# EAGLE design LED-plus35-SHIM (EAGLE 9.6.2)

## Sheet 1 of 3
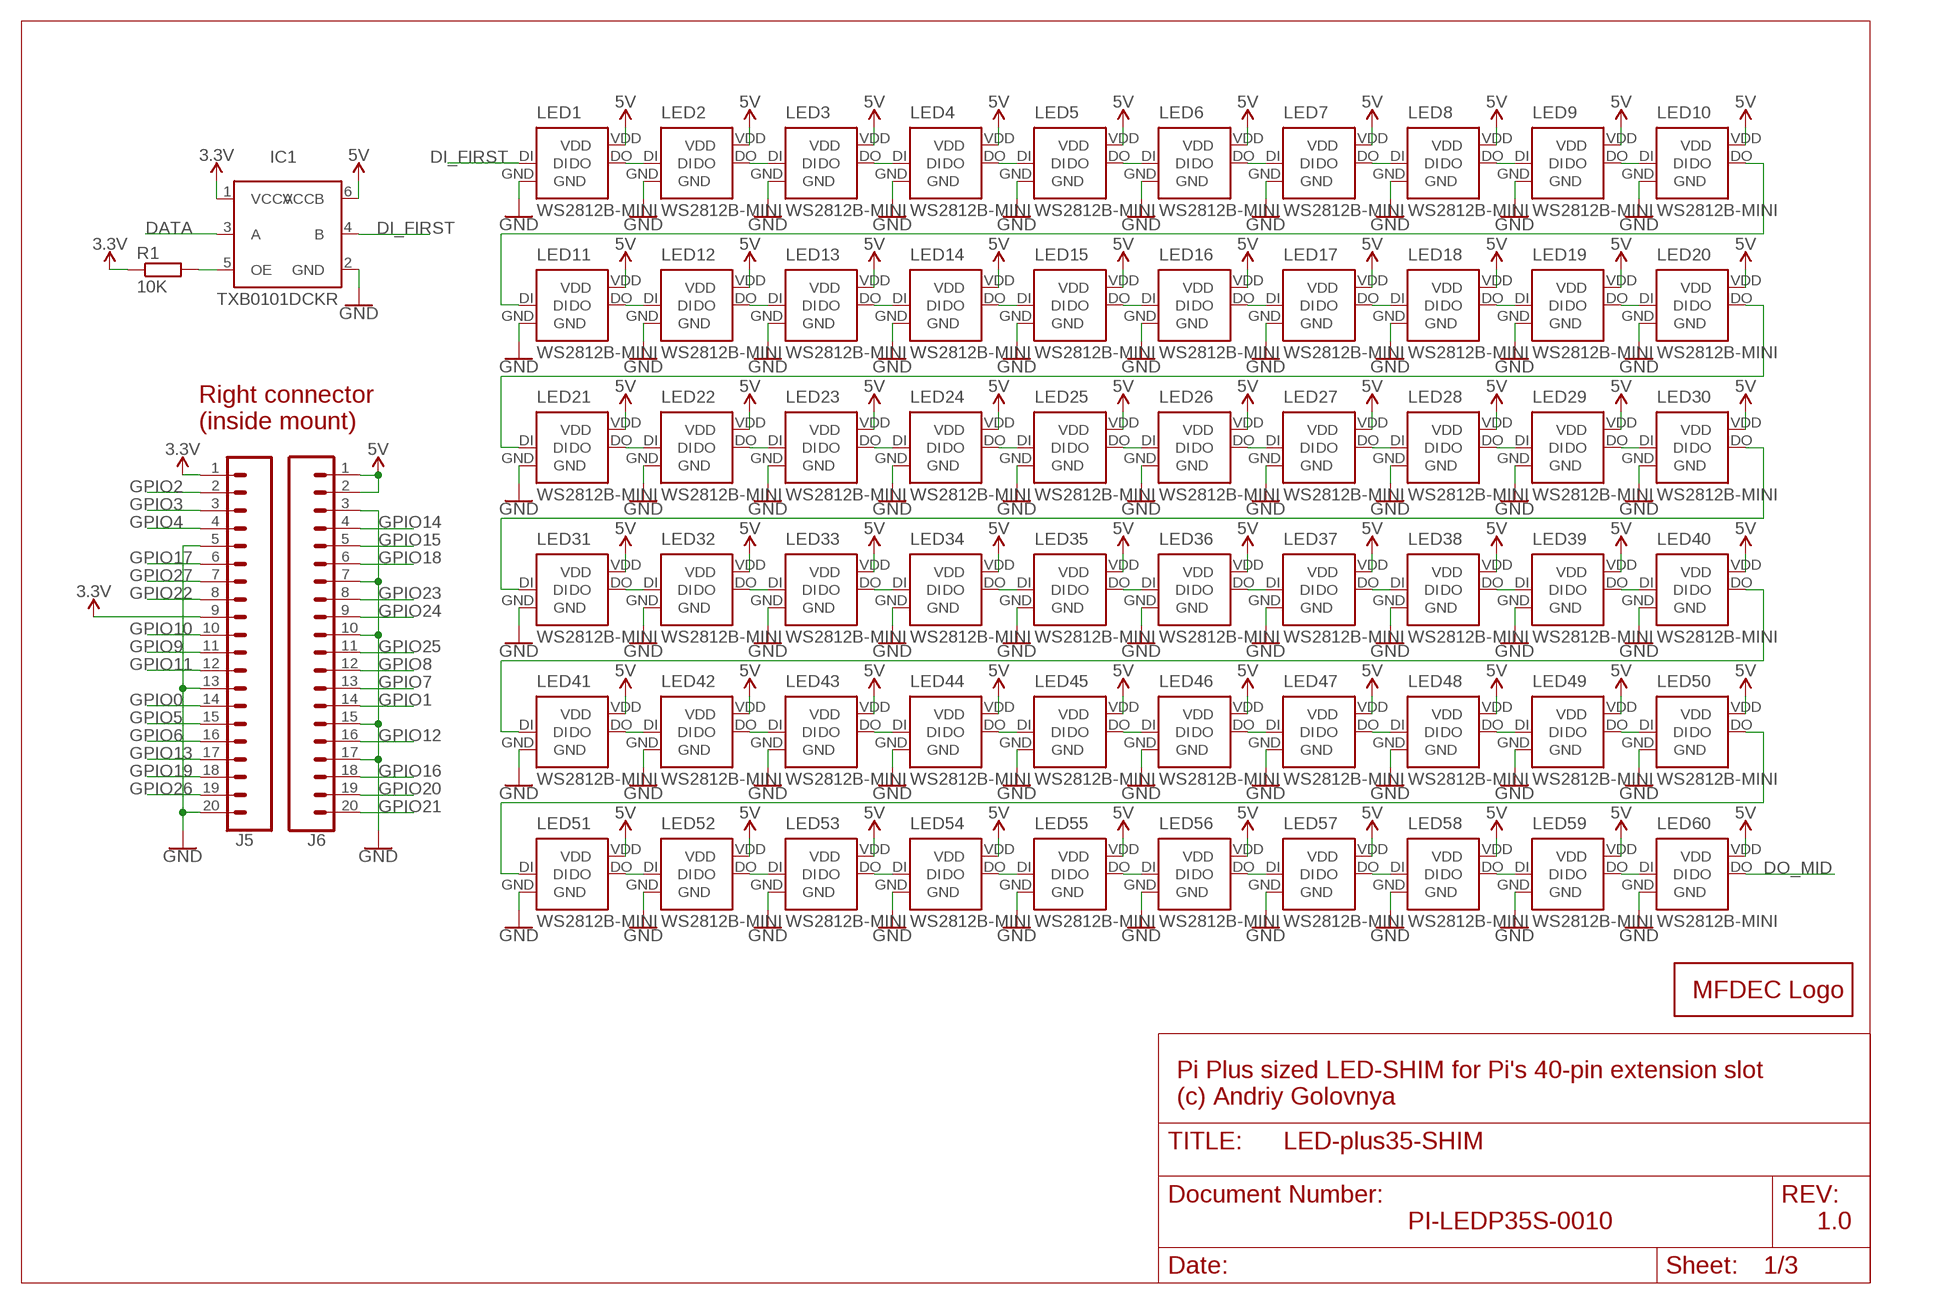
[diagram p0: schematic, sheet 1]

### Parts
IC1  TXB0101DCKR  [SOT65P210X110-6N]
J5  CONN_20LOCK  [1X20_LOCK]
J6  CONN_20LOCK  [1X20_LOCK]
LED1  WS2812B-MINI  [WS2812X-MINI]
LED2  WS2812B-MINI  [WS2812X-MINI]
LED3  WS2812B-MINI  [WS2812X-MINI]
LED4  WS2812B-MINI  [WS2812X-MINI]
LED5  WS2812B-MINI  [WS2812X-MINI]
LED6  WS2812B-MINI  [WS2812X-MINI]
LED7  WS2812B-MINI  [WS2812X-MINI]
LED8  WS2812B-MINI  [WS2812X-MINI]
LED9  WS2812B-MINI  [WS2812X-MINI]
LED10  WS2812B-MINI  [WS2812X-MINI]
LED11  WS2812B-MINI  [WS2812X-MINI]
LED12  WS2812B-MINI  [WS2812X-MINI]
LED13  WS2812B-MINI  [WS2812X-MINI]
LED14  WS2812B-MINI  [WS2812X-MINI]
LED15  WS2812B-MINI  [WS2812X-MINI]
LED16  WS2812B-MINI  [WS2812X-MINI]
LED17  WS2812B-MINI  [WS2812X-MINI]
LED18  WS2812B-MINI  [WS2812X-MINI]
LED19  WS2812B-MINI  [WS2812X-MINI]
LED20  WS2812B-MINI  [WS2812X-MINI]
LED21  WS2812B-MINI  [WS2812X-MINI]
LED22  WS2812B-MINI  [WS2812X-MINI]
LED23  WS2812B-MINI  [WS2812X-MINI]
LED24  WS2812B-MINI  [WS2812X-MINI]
LED25  WS2812B-MINI  [WS2812X-MINI]
LED26  WS2812B-MINI  [WS2812X-MINI]
LED27  WS2812B-MINI  [WS2812X-MINI]
LED28  WS2812B-MINI  [WS2812X-MINI]
LED29  WS2812B-MINI  [WS2812X-MINI]
LED30  WS2812B-MINI  [WS2812X-MINI]
LED31  WS2812B-MINI  [WS2812X-MINI]
LED32  WS2812B-MINI  [WS2812X-MINI]
LED33  WS2812B-MINI  [WS2812X-MINI]
LED34  WS2812B-MINI  [WS2812X-MINI]
LED35  WS2812B-MINI  [WS2812X-MINI]
LED36  WS2812B-MINI  [WS2812X-MINI]
LED37  WS2812B-MINI  [WS2812X-MINI]
LED38  WS2812B-MINI  [WS2812X-MINI]
LED39  WS2812B-MINI  [WS2812X-MINI]
LED40  WS2812B-MINI  [WS2812X-MINI]
LED41  WS2812B-MINI  [WS2812X-MINI]
LED42  WS2812B-MINI  [WS2812X-MINI]
LED43  WS2812B-MINI  [WS2812X-MINI]
LED44  WS2812B-MINI  [WS2812X-MINI]
LED45  WS2812B-MINI  [WS2812X-MINI]
LED46  WS2812B-MINI  [WS2812X-MINI]
LED47  WS2812B-MINI  [WS2812X-MINI]
LED48  WS2812B-MINI  [WS2812X-MINI]
LED49  WS2812B-MINI  [WS2812X-MINI]
LED50  WS2812B-MINI  [WS2812X-MINI]
LED51  WS2812B-MINI  [WS2812X-MINI]
LED52  WS2812B-MINI  [WS2812X-MINI]
LED53  WS2812B-MINI  [WS2812X-MINI]
LED54  WS2812B-MINI  [WS2812X-MINI]
LED55  WS2812B-MINI  [WS2812X-MINI]
LED56  WS2812B-MINI  [WS2812X-MINI]
LED57  WS2812B-MINI  [WS2812X-MINI]
LED58  WS2812B-MINI  [WS2812X-MINI]
LED59  WS2812B-MINI  [WS2812X-MINI]
LED60  WS2812B-MINI  [WS2812X-MINI]
LOGO1  MFDECLOGO_L_40MM  [MFDEC_L_40MM]
R1  10K  R-EU_R0402  [R0402]

### Nets
3.3V: IC1.1(VCCA) J5.1 J5.9 R1.1
5V: IC1.6(VCCB) J6.1 J6.2 LED1.VDD LED2.VDD LED3.VDD LED4.VDD LED5.VDD LED6.VDD LED7.VDD LED8.VDD LED9.VDD LED10.VDD LED11.VDD LED12.VDD LED13.VDD LED14.VDD LED15.VDD LED16.VDD LED17.VDD LED18.VDD LED19.VDD LED20.VDD LED21.VDD LED22.VDD LED23.VDD LED24.VDD LED25.VDD LED26.VDD LED27.VDD LED28.VDD LED29.VDD LED30.VDD LED31.VDD LED32.VDD LED33.VDD LED34.VDD LED35.VDD LED36.VDD LED37.VDD LED38.VDD LED39.VDD LED40.VDD LED41.VDD LED42.VDD LED43.VDD LED44.VDD LED45.VDD LED46.VDD LED47.VDD LED48.VDD LED49.VDD LED50.VDD LED51.VDD LED52.VDD LED53.VDD LED54.VDD LED55.VDD LED56.VDD LED57.VDD LED58.VDD LED59.VDD LED60.VDD ; also sheet 2,3
DATA: IC1.3(A) ; also sheet 2
DI_FIRST: IC1.4(B) LED1.DI ; also sheet 2
DO_MID: LED60.DO ; also sheet 2
GND: IC1.2(GND) J5.5 J5.13 J5.20 J6.3 J6.7 J6.10 J6.15 J6.17 LED1.GND LED2.GND LED3.GND LED4.GND LED5.GND LED6.GND LED7.GND LED8.GND LED9.GND LED10.GND LED11.GND LED12.GND LED13.GND LED14.GND LED15.GND LED16.GND LED17.GND LED18.GND LED19.GND LED20.GND LED21.GND LED22.GND LED23.GND LED24.GND LED25.GND LED26.GND LED27.GND LED28.GND LED29.GND LED30.GND LED31.GND LED32.GND LED33.GND LED34.GND LED35.GND LED36.GND LED37.GND LED38.GND LED39.GND LED40.GND LED41.GND LED42.GND LED43.GND LED44.GND LED45.GND LED46.GND LED47.GND LED48.GND LED49.GND LED50.GND LED51.GND LED52.GND LED53.GND LED54.GND LED55.GND LED56.GND LED57.GND LED58.GND LED59.GND LED60.GND ; also sheet 2,3
GPIO0: J5.14
GPIO1: J6.14
GPIO2: J5.2
GPIO3: J5.3
GPIO4: J5.4
GPIO5: J5.15
GPIO6: J5.16
GPIO7: J6.13
GPIO8: J6.12
GPIO9: J5.11
GPIO10: J5.10 ; also sheet 2
GPIO11: J5.12
GPIO12: J6.16
GPIO13: J5.17
GPIO14: J6.4
GPIO15: J6.5
GPIO16: J6.18
GPIO17: J5.6
GPIO18: J6.6 ; also sheet 2
GPIO19: J5.18
GPIO20: J6.19
GPIO21: J6.20 ; also sheet 2
GPIO22: J5.8
GPIO23: J6.8
GPIO24: J6.9
GPIO25: J6.11
GPIO26: J5.19
GPIO27: J5.7
N$1: LED1.DO LED2.DI
N$2: LED2.DO LED3.DI
N$3: LED3.DO LED4.DI
N$4: LED4.DO LED5.DI
N$5: LED5.DO LED6.DI
N$6: LED6.DO LED7.DI
N$7: LED7.DO LED8.DI
N$8: LED8.DO LED9.DI
N$9: LED9.DO LED10.DI
N$10: LED10.DO LED11.DI
N$11: LED20.DO LED21.DI
N$12: LED11.DO LED12.DI
N$13: LED12.DO LED13.DI
N$14: LED13.DO LED14.DI
N$15: LED14.DO LED15.DI
N$16: LED15.DO LED16.DI
N$17: LED16.DO LED17.DI
N$18: LED17.DO LED18.DI
N$19: LED18.DO LED19.DI
N$20: LED19.DO LED20.DI
N$22: LED21.DO LED22.DI
N$23: LED22.DO LED23.DI
N$24: LED23.DO LED24.DI
N$25: LED24.DO LED25.DI
N$26: LED25.DO LED26.DI
N$27: LED26.DO LED27.DI
N$28: LED27.DO LED28.DI
N$29: LED28.DO LED29.DI
N$30: LED29.DO LED30.DI
N$31: LED30.DO LED31.DI
N$32: LED31.DO LED32.DI
N$33: LED32.DO LED33.DI
N$34: LED33.DO LED34.DI
N$35: LED34.DO LED35.DI
N$36: LED35.DO LED36.DI
N$37: LED36.DO LED37.DI
N$38: LED37.DO LED38.DI
N$39: LED38.DO LED39.DI
N$40: LED39.DO LED40.DI
N$41: LED40.DO LED41.DI
N$42: LED41.DO LED42.DI
N$43: LED42.DO LED43.DI
N$44: LED43.DO LED44.DI
N$45: LED44.DO LED45.DI
N$46: LED45.DO LED46.DI
N$47: LED46.DO LED47.DI
N$48: LED47.DO LED48.DI
N$49: LED48.DO LED49.DI
N$50: LED49.DO LED50.DI
N$51: LED50.DO LED51.DI
N$53: LED51.DO LED52.DI
N$54: LED52.DO LED53.DI
N$55: LED53.DO LED54.DI
N$56: LED54.DO LED55.DI
N$57: LED55.DO LED56.DI
N$58: LED56.DO LED57.DI
N$59: LED57.DO LED58.DI
N$60: LED58.DO LED59.DI
N$61: LED59.DO LED60.DI
N$143: IC1.5(OE) R1.2

### Notes on the sheet
- Right connector
  (inside mount)
- Pi Plus sized LED-SHIM for Pi's 40-pin extension slot
  (c) Andriy Golovnya
- PI-LEDP35S-0010 | 1.0

## Sheet 2 of 3
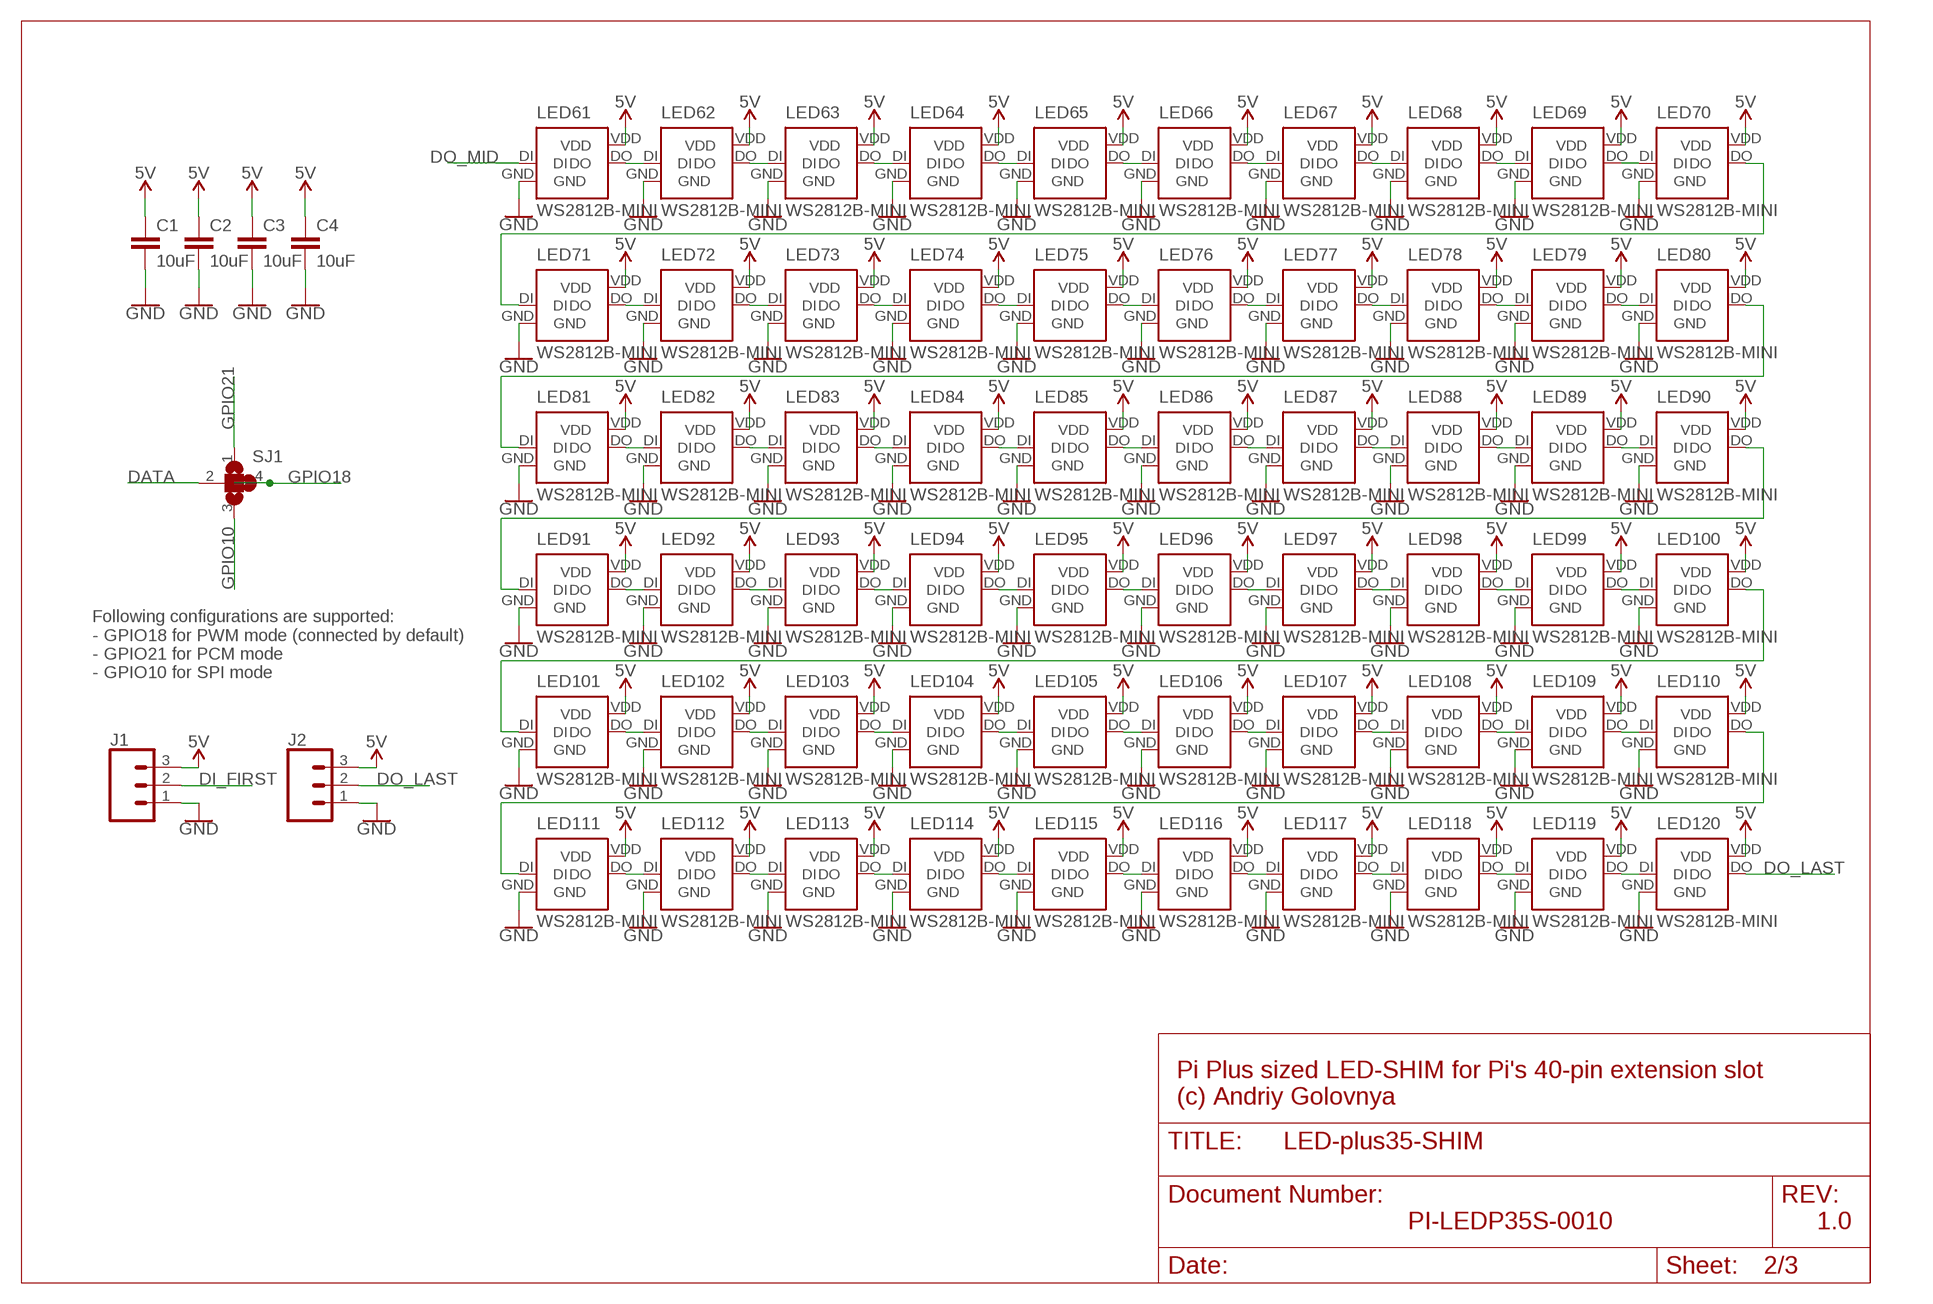
[diagram p1: schematic, sheet 2]

### Parts
C1  10uF  C-EUC0805  [C0805]
C2  10uF  C-EUC0805  [C0805]
C3  10uF  C-EUC0805  [C0805]
C4  10uF  C-EUC0805  [C0805]
J1  CONN_03  [1X03]
J2  CONN_03  [1X03]
LED61  WS2812B-MINI  [WS2812X-MINI]
LED62  WS2812B-MINI  [WS2812X-MINI]
LED63  WS2812B-MINI  [WS2812X-MINI]
LED64  WS2812B-MINI  [WS2812X-MINI]
LED65  WS2812B-MINI  [WS2812X-MINI]
LED66  WS2812B-MINI  [WS2812X-MINI]
LED67  WS2812B-MINI  [WS2812X-MINI]
LED68  WS2812B-MINI  [WS2812X-MINI]
LED69  WS2812B-MINI  [WS2812X-MINI]
LED70  WS2812B-MINI  [WS2812X-MINI]
LED71  WS2812B-MINI  [WS2812X-MINI]
LED72  WS2812B-MINI  [WS2812X-MINI]
LED73  WS2812B-MINI  [WS2812X-MINI]
LED74  WS2812B-MINI  [WS2812X-MINI]
LED75  WS2812B-MINI  [WS2812X-MINI]
LED76  WS2812B-MINI  [WS2812X-MINI]
LED77  WS2812B-MINI  [WS2812X-MINI]
LED78  WS2812B-MINI  [WS2812X-MINI]
LED79  WS2812B-MINI  [WS2812X-MINI]
LED80  WS2812B-MINI  [WS2812X-MINI]
LED81  WS2812B-MINI  [WS2812X-MINI]
LED82  WS2812B-MINI  [WS2812X-MINI]
LED83  WS2812B-MINI  [WS2812X-MINI]
LED84  WS2812B-MINI  [WS2812X-MINI]
LED85  WS2812B-MINI  [WS2812X-MINI]
LED86  WS2812B-MINI  [WS2812X-MINI]
LED87  WS2812B-MINI  [WS2812X-MINI]
LED88  WS2812B-MINI  [WS2812X-MINI]
LED89  WS2812B-MINI  [WS2812X-MINI]
LED90  WS2812B-MINI  [WS2812X-MINI]
LED91  WS2812B-MINI  [WS2812X-MINI]
LED92  WS2812B-MINI  [WS2812X-MINI]
LED93  WS2812B-MINI  [WS2812X-MINI]
LED94  WS2812B-MINI  [WS2812X-MINI]
LED95  WS2812B-MINI  [WS2812X-MINI]
LED96  WS2812B-MINI  [WS2812X-MINI]
LED97  WS2812B-MINI  [WS2812X-MINI]
LED98  WS2812B-MINI  [WS2812X-MINI]
LED99  WS2812B-MINI  [WS2812X-MINI]
LED100  WS2812B-MINI  [WS2812X-MINI]
LED101  WS2812B-MINI  [WS2812X-MINI]
LED102  WS2812B-MINI  [WS2812X-MINI]
LED103  WS2812B-MINI  [WS2812X-MINI]
LED104  WS2812B-MINI  [WS2812X-MINI]
LED105  WS2812B-MINI  [WS2812X-MINI]
LED106  WS2812B-MINI  [WS2812X-MINI]
LED107  WS2812B-MINI  [WS2812X-MINI]
LED108  WS2812B-MINI  [WS2812X-MINI]
LED109  WS2812B-MINI  [WS2812X-MINI]
LED110  WS2812B-MINI  [WS2812X-MINI]
LED111  WS2812B-MINI  [WS2812X-MINI]
LED112  WS2812B-MINI  [WS2812X-MINI]
LED113  WS2812B-MINI  [WS2812X-MINI]
LED114  WS2812B-MINI  [WS2812X-MINI]
LED115  WS2812B-MINI  [WS2812X-MINI]
LED116  WS2812B-MINI  [WS2812X-MINI]
LED117  WS2812B-MINI  [WS2812X-MINI]
LED118  WS2812B-MINI  [WS2812X-MINI]
LED119  WS2812B-MINI  [WS2812X-MINI]
LED120  WS2812B-MINI  [WS2812X-MINI]
SJ1  SJ3  [SJ_3]

### Nets
5V: C1.1 C2.1 C3.1 C4.1 J1.3 J2.3 LED61.VDD LED62.VDD LED63.VDD LED64.VDD LED65.VDD LED66.VDD LED67.VDD LED68.VDD LED69.VDD LED70.VDD LED71.VDD LED72.VDD LED73.VDD LED74.VDD LED75.VDD LED76.VDD LED77.VDD LED78.VDD LED79.VDD LED80.VDD LED81.VDD LED82.VDD LED83.VDD LED84.VDD LED85.VDD LED86.VDD LED87.VDD LED88.VDD LED89.VDD LED90.VDD LED91.VDD LED92.VDD LED93.VDD LED94.VDD LED95.VDD LED96.VDD LED97.VDD LED98.VDD LED99.VDD LED100.VDD LED101.VDD LED102.VDD LED103.VDD LED104.VDD LED105.VDD LED106.VDD LED107.VDD LED108.VDD LED109.VDD LED110.VDD LED111.VDD LED112.VDD LED113.VDD LED114.VDD LED115.VDD LED116.VDD LED117.VDD LED118.VDD LED119.VDD LED120.VDD ; also sheet 1,3
DATA: SJ1.2 ; also sheet 1
DI_FIRST: J1.2 ; also sheet 1
DO_LAST: J2.2 LED120.DO
DO_MID: LED61.DI ; also sheet 1
GND: C1.2 C2.2 C3.2 C4.2 J1.1 J2.1 LED61.GND LED62.GND LED63.GND LED64.GND LED65.GND LED66.GND LED67.GND LED68.GND LED69.GND LED70.GND LED71.GND LED72.GND LED73.GND LED74.GND LED75.GND LED76.GND LED77.GND LED78.GND LED79.GND LED80.GND LED81.GND LED82.GND LED83.GND LED84.GND LED85.GND LED86.GND LED87.GND LED88.GND LED89.GND LED90.GND LED91.GND LED92.GND LED93.GND LED94.GND LED95.GND LED96.GND LED97.GND LED98.GND LED99.GND LED100.GND LED101.GND LED102.GND LED103.GND LED104.GND LED105.GND LED106.GND LED107.GND LED108.GND LED109.GND LED110.GND LED111.GND LED112.GND LED113.GND LED114.GND LED115.GND LED116.GND LED117.GND LED118.GND LED119.GND LED120.GND ; also sheet 1,3
GPIO10: SJ1.3 ; also sheet 1
GPIO18: SJ1.4 ; also sheet 1
GPIO21: SJ1.1 ; also sheet 1
N$52: LED69.DO LED70.DI
N$63: LED61.DO LED62.DI
N$64: LED62.DO LED63.DI
N$65: LED63.DO LED64.DI
N$66: LED64.DO LED65.DI
N$67: LED65.DO LED66.DI
N$68: LED66.DO LED67.DI
N$69: LED67.DO LED68.DI
N$70: LED68.DO LED69.DI
N$71: LED70.DO LED71.DI
N$72: LED71.DO LED72.DI
N$73: LED72.DO LED73.DI
N$74: LED73.DO LED74.DI
N$75: LED74.DO LED75.DI
N$76: LED75.DO LED76.DI
N$77: LED76.DO LED77.DI
N$78: LED77.DO LED78.DI
N$79: LED78.DO LED79.DI
N$80: LED79.DO LED80.DI
N$81: LED80.DO LED81.DI
N$82: LED81.DO LED82.DI
N$83: LED82.DO LED83.DI
N$84: LED83.DO LED84.DI
N$85: LED84.DO LED85.DI
N$86: LED85.DO LED86.DI
N$87: LED86.DO LED87.DI
N$88: LED87.DO LED88.DI
N$89: LED88.DO LED89.DI
N$90: LED89.DO LED90.DI
N$91: LED90.DO LED91.DI
N$92: LED91.DO LED92.DI
N$93: LED92.DO LED93.DI
N$94: LED93.DO LED94.DI
N$95: LED94.DO LED95.DI
N$96: LED95.DO LED96.DI
N$97: LED96.DO LED97.DI
N$98: LED97.DO LED98.DI
N$99: LED98.DO LED99.DI
N$100: LED99.DO LED100.DI
N$101: LED100.DO LED101.DI
N$102: LED101.DO LED102.DI
N$103: LED102.DO LED103.DI
N$104: LED103.DO LED104.DI
N$105: LED104.DO LED105.DI
N$106: LED105.DO LED106.DI
N$107: LED106.DO LED107.DI
N$108: LED107.DO LED108.DI
N$109: LED108.DO LED109.DI
N$110: LED109.DO LED110.DI
N$111: LED110.DO LED111.DI
N$112: LED111.DO LED112.DI
N$113: LED112.DO LED113.DI
N$114: LED113.DO LED114.DI
N$115: LED114.DO LED115.DI
N$116: LED115.DO LED116.DI
N$117: LED116.DO LED117.DI
N$118: LED117.DO LED118.DI
N$119: LED118.DO LED119.DI
N$120: LED119.DO LED120.DI

### Notes on the sheet
- Following configurations are supported:
  - GPIO18 for PWM mode (connected by default)
  - GPIO21 for PCM mode
  - GPIO10 for SPI mode
- Pi Plus sized LED-SHIM for Pi's 40-pin extension slot
  (c) Andriy Golovnya
- PI-LEDP35S-0010 | 1.0

## Sheet 3 of 3
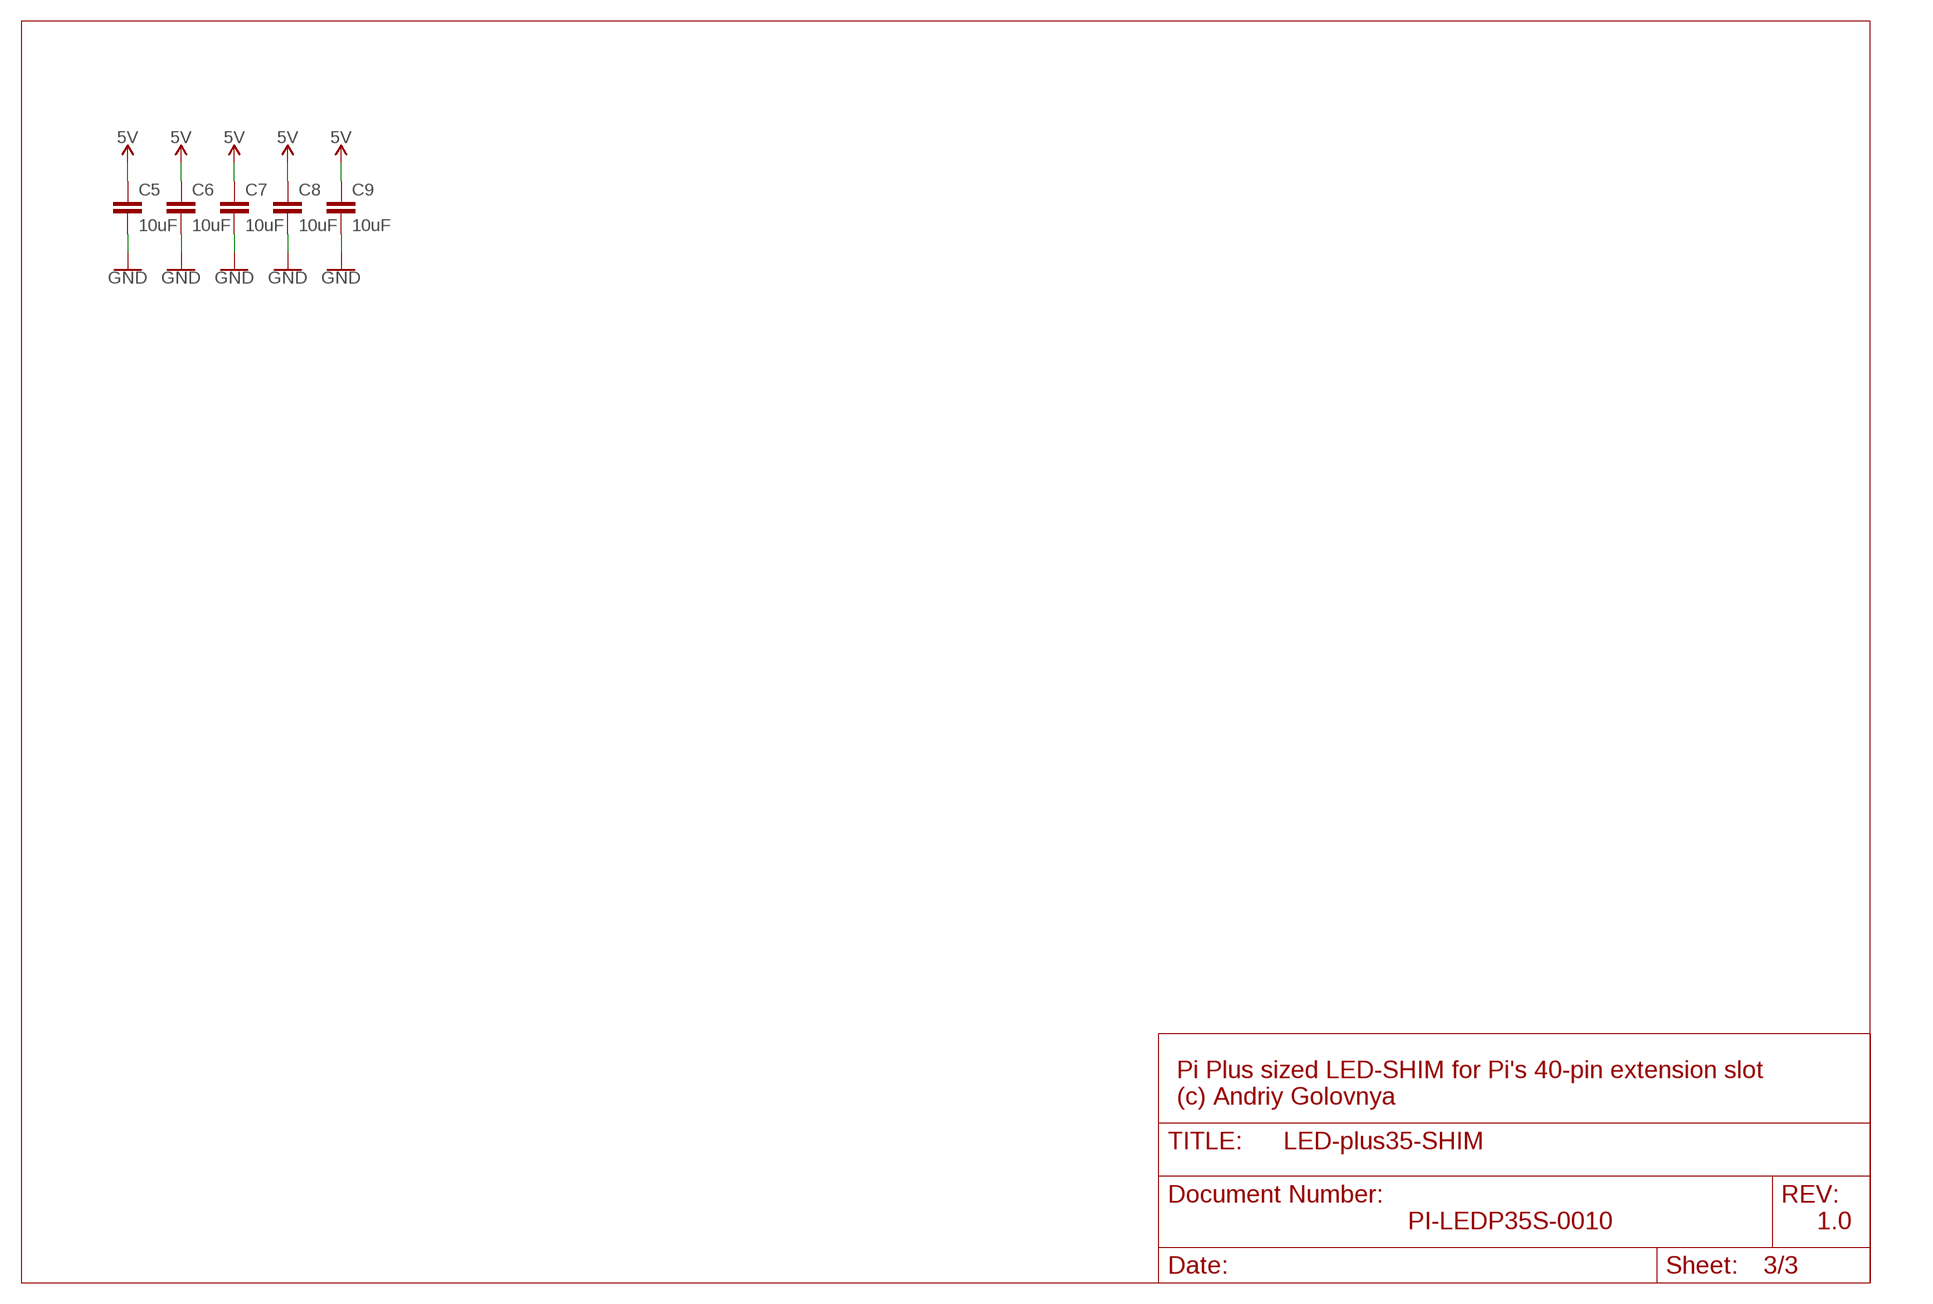
[diagram p2: schematic, sheet 3]

### Parts
C5  10uF  C-EUC0805  [C0805]
C6  10uF  C-EUC0805  [C0805]
C7  10uF  C-EUC0805  [C0805]
C8  10uF  C-EUC0805  [C0805]
C9  10uF  C-EUC0805  [C0805]

### Nets
5V: C5.1 C6.1 C7.1 C8.1 C9.1 ; also sheet 1,2
GND: C5.2 C6.2 C7.2 C8.2 C9.2 ; also sheet 1,2

### Notes on the sheet
- Pi Plus sized LED-SHIM for Pi's 40-pin extension slot
  (c) Andriy Golovnya
- PI-LEDP35S-0010 | 1.0

## Library data of the parts
C1-C9 = rcl:C-EU: CAPACITOR, European symbol; SPICEPREFIX: C
IC1 = TXB0101DCKR:TXB0101DCKR
J1 J2 = SparkFun-Connectors:CONN_03: Multi connection point. Often used as Generic Header-pin footprint for 0.1 inch spaced/style header connections On any of the 0.1 inch spaced packages, you can populate with these: Break Away Headers - Straight <https://www.sparkfun.com/products/116> (PRT-00116) Break Away Male Headers - Right Angle <https://www.sparkfun.com/products/553> (PRT-00553) Female Headers <https://www.sparkfun.com/products/115> (PRT-00115) Break Away Headers - Machine Pin <https://www.sparkfun.com/products/117> (PRT-00117) Break Away Female Headers - Swiss Machine Pin <https://www.sparkfun.com/products/743> (PRT-00743) Stackable Header - 3 Pin (Female, 0.1") <https://www.sparkfun.com/products/13875> (PRT-13875) For SCREWTERMINALS and SPRING TERMINALS visit here: Screw Terimnals on SparkFun.com <https://www.sparkfun.com/search/results?term=Screw+Terminals> (5mm/3.5mm/2.54mm spacing) This device is also useful as a general connection point to wire up your design to another part of your project. Our various solder wires solder well into these plated through hole pads. Hook-Up Wire - Assortment (Stranded, 22 AWG) <https://www.sparkfun.com/products/11375> (PRT-11375) Hook-Up Wire - Assortment (Solid Core, 22 AWG) <https://www.sparkfun.com/products/11367> (PRT-11367) View the entire wire category on our website here <https://www.sparkfun.com/categories/141> Special notes: Molex polarized connector foot print use with SKU : PRT-08232 with associated crimp pins and housings.
J5 J6 = _my_locked_connectors:CONN_20: Multi connection point. Often used as Generic Header-pin footprint for 0.1 inch spaced/style header connections On any of the 0.1 inch spaced packages, you can populate with these: Break Away Headers - Straight <https://www.sparkfun.com/products/116> (PRT-00116) Break Away Male Headers - Right Angle <https://www.sparkfun.com/products/553> (PRT-00553) Female Headers <https://www.sparkfun.com/products/115> (PRT-00115) Break Away Headers - Machine Pin <https://www.sparkfun.com/products/117> (PRT-00117) Break Away Female Headers - Swiss Machine Pin <https://www.sparkfun.com/products/743> (PRT-00743) For SCREWTERMINALS and SPRING TERMINALS visit here: Screw Terimnals on SparkFun.com <https://www.sparkfun.com/search/results?term=Screw+Terminals> (5mm/3.5mm/2.54mm spacing) This device is also useful as a general connection point to wire up your design to another part of your project. Our various solder wires solder well into these plated through hole pads. Hook-Up Wire - Assortment (Stranded, 22 AWG) <https://www.sparkfun.com/products/11375> (PRT-11375) Hook-Up Wire - Assortment (Solid Core, 22 AWG) <https://www.sparkfun.com/products/11367> (PRT-11367) View the entire wire category on our website here <https://www.sparkfun.com/categories/141> Special notes: Molex polarized connector foot print use with SKU : PRT-08231 with associated crimp pins and housings. 1MM SMD Version SKU: PRT-10208 NOTES ON THE VARIANTS LOCK and LOCK_LONGPADS... This footprint was designed to help hold the alignment of a through-hole component (i.e. 6-pin header) while soldering it into place. You may notice that each hole has been shifted either up or down by 0.005 of an inch from it's more standard position (which is a perfectly straight line). This slight alteration caused the pins (the squares in the middle) to touch the edges of the holes. Because they are alternating, it causes a "brace" to hold the component in place. 0.005 has proven to be the perfect amount of "off-center" position when using our standard breakaway headers. Although looks a little odd when you look at the bare footprint, once you have a header in there, the alteration is very hard to notice. Also,if you push a header all the way into place, it is covered up entirely on the bottom side. Note about LOCK SPECIAL package: This is just like the LOCK variant in that the holes are staggared by 5 mil, but except for the last two holes. They are not altered from the "standard" footprint layout. This is used for a special purpose on the layout of our Graphic LCD Backpack. Make sure you want to use this device before selecting it for you project!
LED1-LED120 = WS281X:WS2812: WS2812 RGB LED
LOGO1 = _my_logos:MFDECLOGO: Midnight Fog - Digital Eye Candy LOGO
R1 = rcl:R-EU_: RESISTOR, European symbol; SPICEPREFIX: R
SJ1 = _my_jumpers:SJ3: SMD solder JUMPER SJ3 - simple jumper SJ3FI - fancy inside jumper SJ3FO - fancy outside jumper SJ3W - wide jumper

## Board
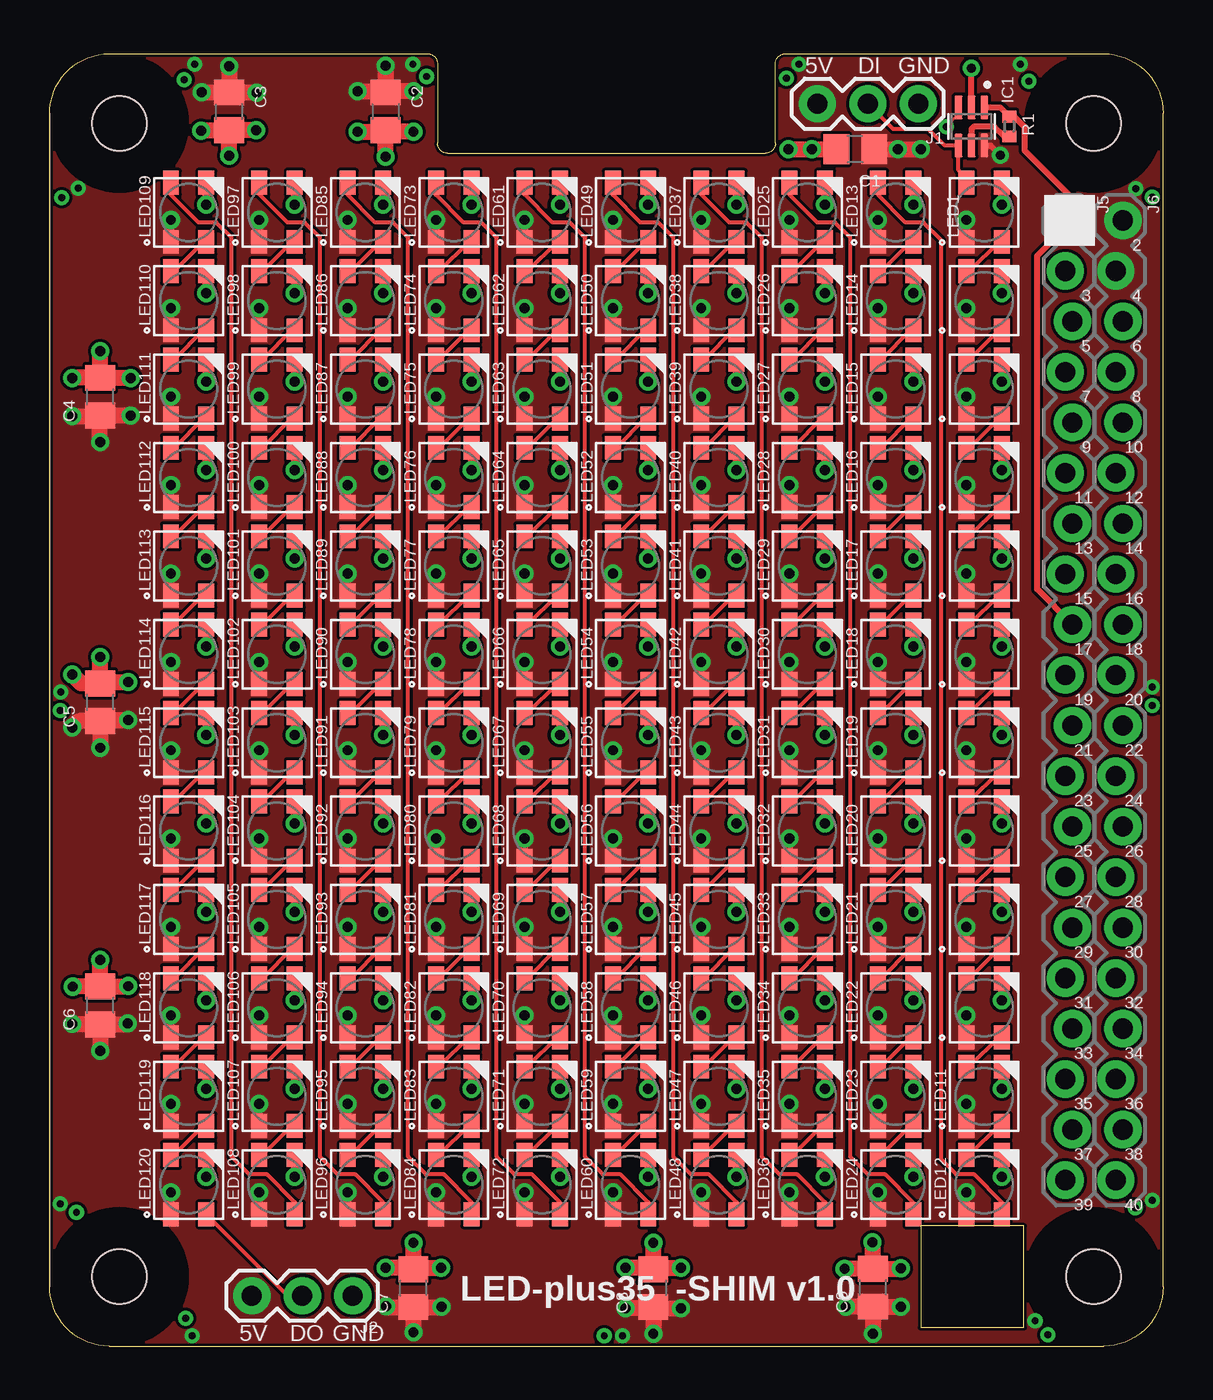
[diagram p3: board, top side]
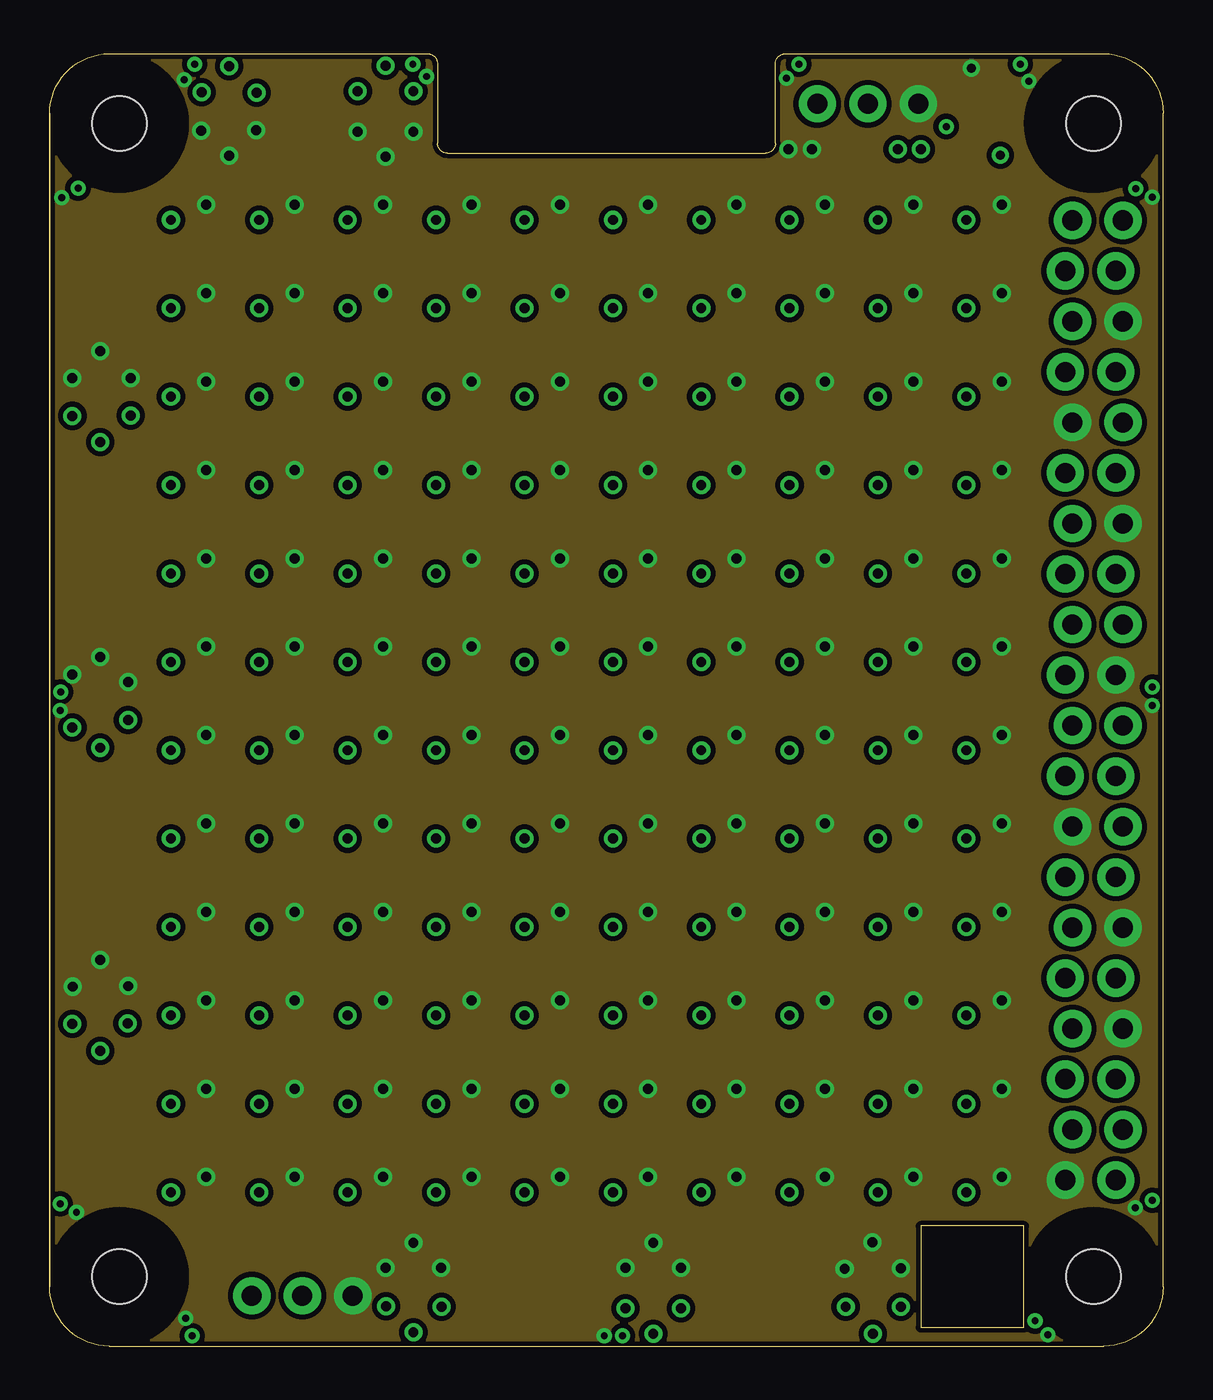
[diagram p4: board, inner layer Route2]
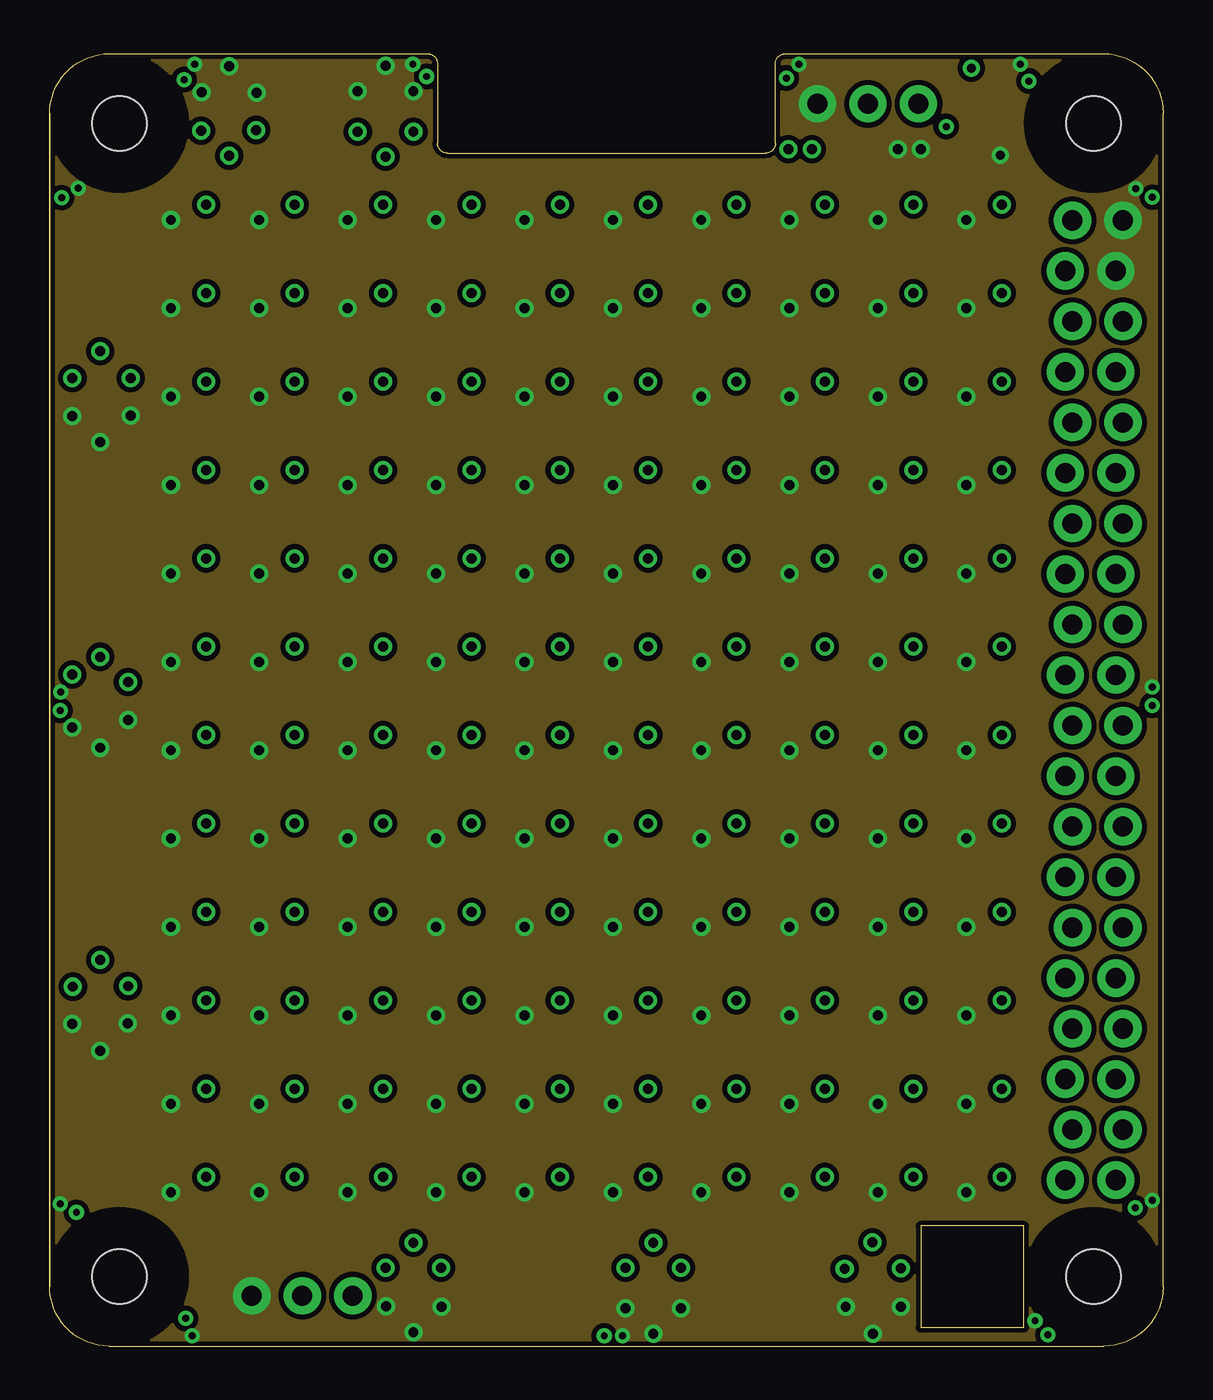
[diagram p5: board, inner layer Route15]
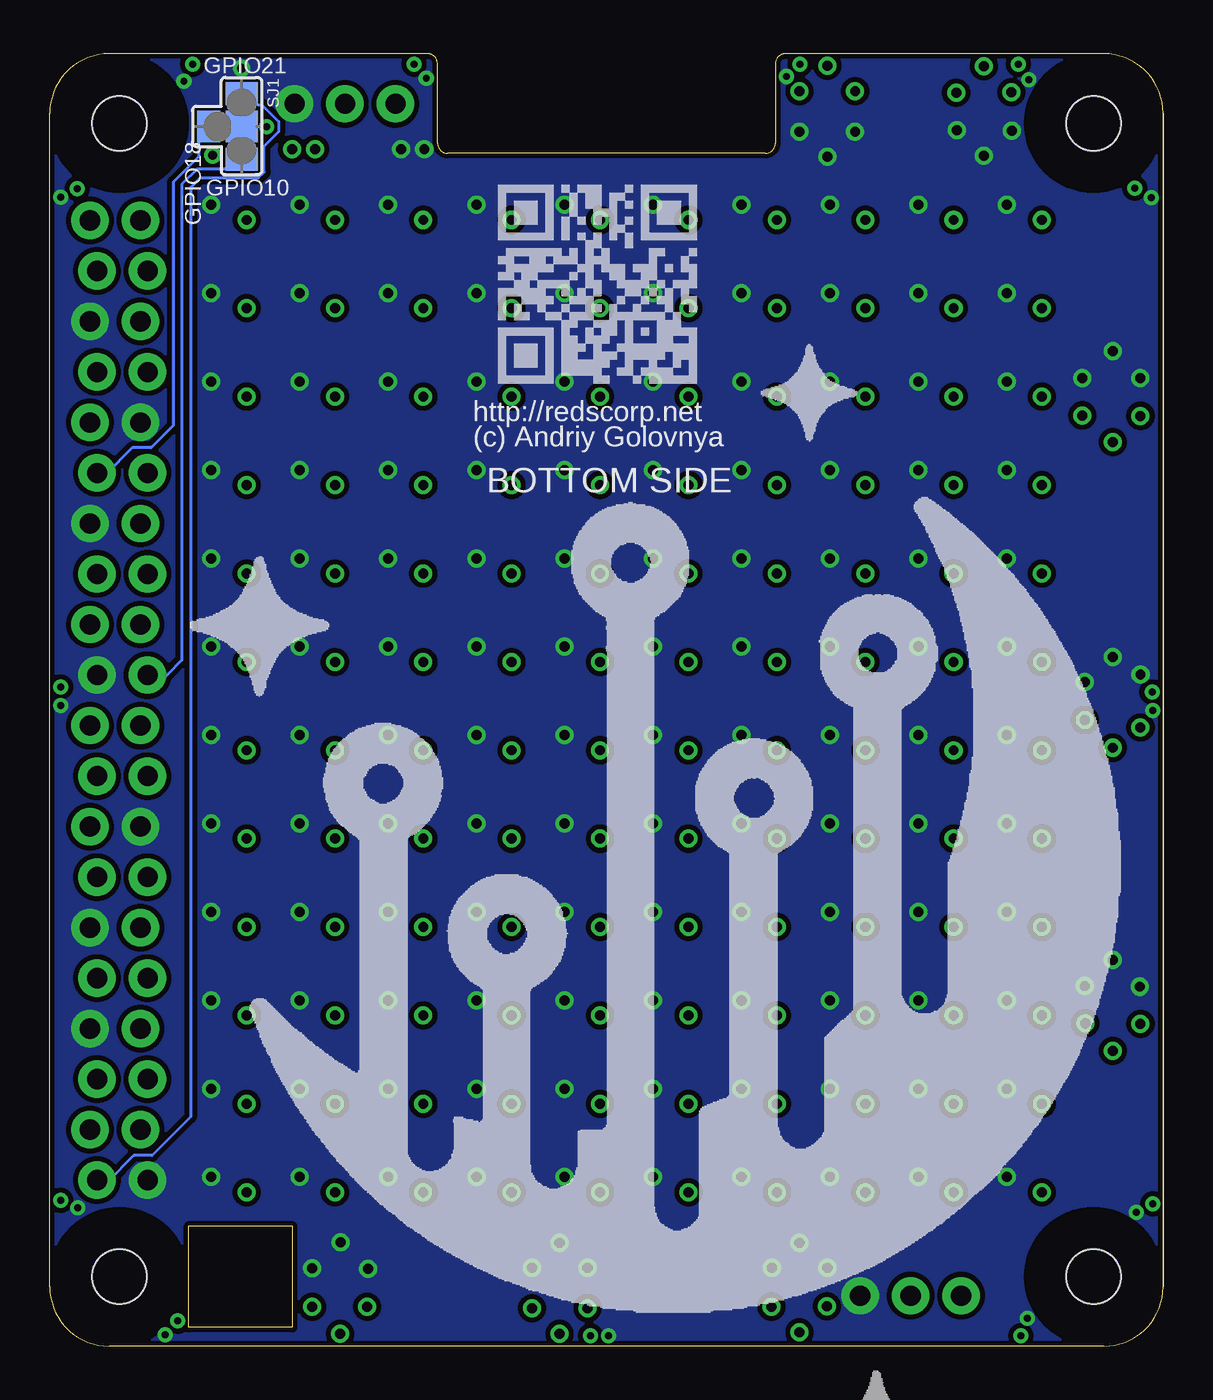
[diagram p6: board, bottom side, seen from below]

Size 56 x 65 mm. Coordinates in mm from the lower left corner, seen from the top.
Outline: 0,3 arc0 0,3 0,62 arc0 0,62
Outline: 0,62 0,3
Outline: 0,3 arc90 3,0 53,0 arc90 56,3 56,62 arc90 53,65 37,65 arc90 36.5,64.5 36.5,60.5 arc-90 36,60 20,60 arc-90 19.5,60.5 19.5,64.5 arc90 19,65 3,65 arc90 0,62
Outline: 43.8,0.95 49,0.95 49,6.05 43.8,6.05 43.8,0.95
Copper layers (1+2*15+16): Top 0.035mm / dielectric 0.2mm / Route2 0.035mm / dielectric 1.5mm / Route15 0.035mm / dielectric 0.2mm / Bottom 0.035mm
Design rules "default *": minimum track width 6mil, minimum drill 0.35mm, track to track 6mil, track to pad 6mil, pad to pad 6mil, via to via 6mil, smd to smd 6mil, copper to edge 6mil, drill to drill 6mil, minimum pad ring 10mil, minimum via ring 8mil, stop-mask expansion 4mil, vias tented up to drill 20mil, thermal gap 10mil
Holes 2.75 mm at 3.5,3.5 52.5,3.5 3.5,61.5 52.5,61.5

### Footprints (pad centres in the part's own frame; a part is rotated, then mirrored left to right if it is on the bottom)
C0805 = smd 1.3 x 1.5: 1 -0.95,0; 2 0.95,0
SOT65P210X110-6N = smd 1.19 x 0.4: 1 -0.96,0.65; 2 -0.96,0; 3 -0.96,-0.65; 4 0.96,-0.65; 5 0.96,0; 6 0.96,0.65
1X03 = drill 1.016 pad 1.88: 1 0,0; 2 2.54,0; 3 5.08,0
1X20_LOCK = drill 1.016 pad 1.88: 1 0,0.178; 2 2.54,-0.178; 3 5.08,0.178; 4 7.62,-0.178; 5 10.16,0.178; 6 12.7,-0.178; 7 15.24,0.178; 8 17.78,-0.178; 9 20.32,0.178; 10 22.86,-0.178; 11 25.4,0.178; 12 27.94,-0.178; 13 30.48,0.178; 14 33.02,-0.178; 15 35.56,0.178; 16 38.1,-0.178; 17 40.64,0.178; 18 43.18,-0.178; 19 45.72,0.178; 20 48.26,-0.178
WS2812X-MINI = smd 1.2 x 0.8: DI 1.49,0.89; DO -1.49,-0.89; GND 1.49,-0.89; VDD -1.49,0.89
R0402 = smd 0.6 x 0.7: 1 -0.5,0; 2 0.5,0
SJ_3 = smd 1.168 x 1.6: 1 -1.651,0; 3 1.651,0 | smd 1.6 x 1.6: 2 0,0 | smd 1.6 x 1.168: 4 0,-1.651

### Placement (x,y rotation side)
C1  40.51,60.2 180 top
C2  16.89,62.1 270 top
C3  9.02,62.1 270 top
C4  2.54,47.75 90 top
C5  2.54,32.38 90 top
C6  2.54,17.14 90 top
C7  18.29,2.92 90 top
C8  30.35,2.92 90 top
C9  41.4,2.95 90 top
IC1  46.36,61.34 270 top
J1  43.69,62.48 180 top
J2  15.24,2.54 180 top
J5  51.25,56.62 270 top
J6  53.79,56.62 270 top
LED1  46.99,57.02 90 top
LED2  46.99,52.58 90 top
LED3  46.99,48.13 90 top
LED4  46.99,43.69 90 top
LED5  46.99,39.24 90 top
LED6  46.99,34.8 90 top
LED7  46.99,30.35 90 top
LED8  46.99,25.91 90 top
LED9  46.99,21.46 90 top
LED10  46.99,17.02 90 top
LED11  46.99,12.57 90 top
LED12  46.99,8.13 90 top
LED13  42.55,57.02 90 top
LED14  42.55,52.58 90 top
LED15  42.55,48.13 90 top
LED16  42.55,43.69 90 top
LED17  42.55,39.24 90 top
LED18  42.55,34.8 90 top
LED19  42.55,30.35 90 top
LED20  42.55,25.91 90 top
LED21  42.55,21.46 90 top
LED22  42.55,17.02 90 top
LED23  42.55,12.57 90 top
LED24  42.55,8.13 90 top
LED25  38.1,57.02 90 top
LED26  38.1,52.58 90 top
LED27  38.1,48.13 90 top
LED28  38.1,43.69 90 top
LED29  38.1,39.24 90 top
LED30  38.1,34.8 90 top
LED31  38.1,30.35 90 top
LED32  38.1,25.91 90 top
LED33  38.1,21.46 90 top
LED34  38.1,17.02 90 top
LED35  38.1,12.57 90 top
LED36  38.1,8.13 90 top
LED37  33.66,57.02 90 top
LED38  33.66,52.58 90 top
LED39  33.66,48.13 90 top
LED40  33.66,43.69 90 top
LED41  33.66,39.24 90 top
LED42  33.66,34.8 90 top
LED43  33.66,30.35 90 top
LED44  33.66,25.91 90 top
LED45  33.66,21.46 90 top
LED46  33.66,17.02 90 top
LED47  33.66,12.57 90 top
LED48  33.66,8.13 90 top
LED49  29.21,57.02 90 top
LED50  29.21,52.58 90 top
LED51  29.21,48.13 90 top
LED52  29.21,43.69 90 top
LED53  29.21,39.24 90 top
LED54  29.21,34.8 90 top
LED55  29.21,30.35 90 top
LED56  29.21,25.91 90 top
LED57  29.21,21.46 90 top
LED58  29.21,17.02 90 top
LED59  29.21,12.57 90 top
LED60  29.21,8.13 90 top
LED61  24.77,57.02 90 top
LED62  24.77,52.58 90 top
LED63  24.77,48.13 90 top
LED64  24.77,43.69 90 top
LED65  24.77,39.24 90 top
LED66  24.77,34.8 90 top
LED67  24.77,30.35 90 top
LED68  24.77,25.91 90 top
LED69  24.77,21.46 90 top
LED70  24.77,17.02 90 top
LED71  24.77,12.57 90 top
LED72  24.77,8.13 90 top
LED73  20.32,57.02 90 top
LED74  20.32,52.58 90 top
LED75  20.32,48.13 90 top
LED76  20.32,43.69 90 top
LED77  20.32,39.24 90 top
LED78  20.32,34.8 90 top
LED79  20.32,30.35 90 top
LED80  20.32,25.91 90 top
LED81  20.32,21.46 90 top
LED82  20.32,17.02 90 top
LED83  20.32,12.57 90 top
LED84  20.32,8.13 90 top
LED85  15.88,57.02 90 top
LED86  15.88,52.58 90 top
LED87  15.88,48.13 90 top
LED88  15.88,43.69 90 top
LED89  15.88,39.24 90 top
LED90  15.88,34.8 90 top
LED91  15.88,30.35 90 top
LED92  15.88,25.91 90 top
LED93  15.88,21.46 90 top
LED94  15.88,17.02 90 top
LED95  15.88,12.57 90 top
LED96  15.88,8.13 90 top
LED97  11.43,57.02 90 top
LED98  11.43,52.58 90 top
LED99  11.43,48.13 90 top
LED100  11.43,43.69 90 top
LED101  11.43,39.24 90 top
LED102  11.43,34.8 90 top
LED103  11.43,30.35 90 top
LED104  11.43,25.91 90 top
LED105  11.43,21.46 90 top
LED106  11.43,17.02 90 top
LED107  11.43,12.57 90 top
LED108  11.43,8.13 90 top
LED109  6.99,57.02 90 top
LED110  6.99,52.58 90 top
LED111  6.99,48.13 90 top
LED112  6.99,43.69 90 top
LED113  6.99,39.24 90 top
LED114  6.99,34.8 90 top
LED115  6.99,30.35 90 top
LED116  6.99,25.91 90 top
LED117  6.99,21.46 90 top
LED118  6.99,17.02 90 top
LED119  6.99,12.57 90 top
LED120  6.99,8.13 90 top
LOGO1  -1.52,-10.03 90 bottom  (outside the outline)
LOGO3  RSNURL_QR_10MM  [RSNURL_QR_10MM]  33.45,48.42 0 bottom
R1  48.26,61.34 270 top
SJ1  46.36,61.34 270 bottom

### Tracks (layer width: path | path; a pad name or v marks a point on that pad's centre or on a via)
3.3V
  Top 0.305: IC1.1 47.8,62.3 R1.1 48.52,61.84 49.02,61.34 49.02,60.15 51.43,57.74 J5.1 49.66,54.84 49.66,38.07 J5.9
5V  (via drill 0.35, 0.45, 0.5)
  Top 0.305: IC1.6 47.32,60.38 v47.8,59.89
  Top 0.406: LED1.VDD v46.1,56.64 | LED2.VDD v46.1,52.2 | LED3.VDD v46.1,47.75 | LED4.VDD v46.1,43.31 | LED5.VDD v46.1,38.86 | LED6.VDD v46.1,34.42 | LED7.VDD v46.1,29.97 | LED8.VDD v46.1,25.53 | LED10.VDD v46.1,16.64 | LED11.VDD v46.1,12.19 | LED12.VDD v46.1,7.75 | LED9.VDD v46.1,21.08 | LED13.VDD v41.66,56.64 | LED14.VDD v41.66,52.2 | LED15.VDD v41.66,47.75 | LED16.VDD v41.66,43.31 | LED17.VDD v41.66,38.86 | LED18.VDD v41.66,34.42 | LED19.VDD v41.66,29.97 | LED20.VDD v41.66,25.53 | LED21.VDD v41.66,21.08 | LED22.VDD v41.66,16.64 | LED23.VDD v41.66,12.19 | LED24.VDD v41.66,7.75 | LED25.VDD v37.21,56.64 | LED26.VDD v37.21,52.2 | LED27.VDD v37.21,47.75 | LED28.VDD v37.21,43.31 | LED29.VDD v37.21,38.86 | LED30.VDD v37.21,34.42 | LED31.VDD v37.21,29.97 | LED32.VDD v37.21,25.53 | LED33.VDD v37.21,21.08 | LED34.VDD v37.21,16.64 | LED35.VDD v37.21,12.19 | LED36.VDD v37.21,7.75 | LED37.VDD v32.77,56.64 | LED38.VDD v32.77,52.2 | LED39.VDD v32.77,47.75 | LED40.VDD v32.77,43.31 | LED41.VDD v32.77,38.86 | LED42.VDD v32.77,34.42 | LED43.VDD v32.77,29.97 | LED44.VDD v32.77,25.53 | LED45.VDD v32.77,21.08 | LED46.VDD v32.77,16.64 | LED47.VDD v32.77,12.19 | LED48.VDD v32.77,7.75 | LED49.VDD v28.32,56.64 | LED50.VDD v28.32,52.2 | LED51.VDD v28.32,47.75 | LED52.VDD v28.32,43.31 | LED53.VDD v28.32,38.86 | LED54.VDD v28.32,34.42 | LED55.VDD v28.32,29.97 | LED56.VDD v28.32,25.53 | LED57.VDD v28.32,21.08 | LED58.VDD v28.32,16.64 | LED59.VDD v28.32,12.19 | LED60.VDD v28.32,7.75 | LED61.VDD v23.88,56.64 | LED62.VDD v23.88,52.2 | LED63.VDD v23.88,47.75 | LED64.VDD v23.88,43.31 | LED65.VDD v23.88,38.86 | LED66.VDD v23.88,34.42 | LED67.VDD v23.88,29.97 | LED68.VDD v23.88,25.53 | LED69.VDD v23.88,21.08 | LED70.VDD v23.88,16.64
  Top 0.406: LED71.VDD v23.88,12.19 | LED72.VDD v23.88,7.75 | LED73.VDD v19.43,56.64 | LED74.VDD v19.43,52.2 | LED75.VDD v19.43,47.75 | LED76.VDD v19.43,43.31 | LED77.VDD v19.43,38.86 | LED78.VDD v19.43,34.42 | LED79.VDD v19.43,29.97 | LED80.VDD v19.43,25.53 | LED81.VDD v19.43,21.08 | LED82.VDD v19.43,16.64 | LED83.VDD v19.43,12.19 | LED84.VDD v19.43,7.75 | LED85.VDD v14.99,56.64 | LED86.VDD v14.99,52.2 | LED87.VDD v14.99,47.75 | LED88.VDD v14.99,43.31 | LED89.VDD v14.99,38.86 | LED90.VDD v14.99,34.42 | LED91.VDD v14.99,29.97 | LED92.VDD v14.99,25.53 | LED93.VDD v14.99,21.08 | LED94.VDD v14.99,16.64 | LED95.VDD v14.99,12.19 | LED96.VDD v14.99,7.75 | LED97.VDD v10.54,56.64 | LED109.VDD v6.1,56.64 | LED98.VDD v10.54,52.2 | LED110.VDD v6.1,52.2 | LED99.VDD v10.54,47.75 | LED111.VDD v6.1,47.75 | LED100.VDD v10.54,43.31 | LED112.VDD v6.1,43.31 | LED101.VDD v10.54,38.86 | LED113.VDD v6.1,38.86 | LED102.VDD v10.54,34.42 | LED114.VDD v6.1,34.42 | LED103.VDD v10.54,29.97 | LED115.VDD v6.1,29.97 | LED104.VDD v10.54,25.53 | LED116.VDD v6.1,25.53 | LED105.VDD v10.54,21.08 | LED117.VDD v6.1,21.08 | LED106.VDD v10.54,16.64 | LED118.VDD v6.1,16.64 | LED107.VDD v10.54,12.19 | LED119.VDD v6.1,12.19 | LED108.VDD v10.54,7.75 | LED120.VDD v6.1,7.75
  Top 0.813: v1.14,46.79 2.53,46.79 | 2.53,46.79 C4.1 v4.05,46.8 v4.06,46.81 | v2.54,45.47 2.53,45.48 2.53,46.79 | C6.1 v2.54,14.86 | C6.1 1.15,16.2 v1.14,16.2 | C6.1 3.88,16.2 v3.91,16.23 | C5.1 v2.54,30.1 | C5.1 2.6,31.5 v3.94,31.5 | C5.1 1.46,31.43 v1.14,31.11 | C9.1 v41.4,0.64 | C9.1 40.05,2 v40.03,1.98 | C9.1 42.78,2 v42.8,1.98 | C8.1 v30.35,0.64 | C8.1 30.29,1.91 v28.96,1.91 | C8.1 30.42,1.91 v31.75,1.91 | v9.02,64.36 C3.1 | v10.41,63.04 C3.1 | v7.65,63.07 9,63.07 C3.1 | v19.71,1.98 v19.7,1.97 C7.1 | v18.29,0.71 C7.1 | v16.92,2.01 16.95,1.97 C7.1 | C1.1 v42.65,60.2 v43.82,60.2 | v15.49,63.12 16.83,63.12 | 16.83,63.12 C2.1 | v18.29,63.12 16.89,63.12 | 16.89,63.12 16.83,63.12 | v16.89,64.39 16.89,63.12
  other vias: 48.82,64.47 54.61,58.22 7.29,64.47 1.42,58.24 0.53,7.16 7.16,0.53 55.45,7.34 49.56,1.27 0.56,32.89 55.45,33.15 28.8,0.53 18.26,64.47 37.67,64.47
  pour Route15 (isolate 0.254, no thermals): 0,-3.81 0,65.15 56.01,65.15 56.01,-3.81
  pour Top (no thermals): 56.01,0 -4.32,0 -4.32,65.15 56.01,65.15
DATA  (via drill 0.35)
  Top 0.152: v45.09,61.34 45.71,61.96 IC1.3
  Bottom 0.152: SJ1.2 v45.09,61.34
DI_FIRST
  Top 0.203: J1.2 42.42,61.21 44.2,61.21 45.03,60.38 IC1.4 45.71,59.15 46.1,58.75 LED1.DI
DO_LAST
  Top 0.203: LED120.DO 11.97,2.54 J2.2
DO_MID
  Top 0.203: LED60.DO 30.1,7.25 28.71,8.64 27.82,8.64 26.92,9.53 26.92,55.75 26.16,56.51 25.29,56.51 23.88,57.93 LED61.DI
GND  (via drill 0.35, 0.45, 0.5)
  Top 0.305: IC1.2 v46.36,64.26
  Top 0.406: LED1.GND v47.88,57.41 v47.88,57.4 | LED2.GND v47.88,52.96 | LED3.GND v47.88,48.52 v47.88,48.51 | LED4.GND v47.88,44.07 | LED5.GND v47.88,39.62 | LED6.GND v47.88,35.18 | LED7.GND v47.88,30.73 | LED8.GND v47.88,26.29 | LED10.GND v47.88,17.4 | LED11.GND v47.88,12.96 v47.88,12.95 | LED12.GND v47.88,8.51 | LED9.GND v47.88,21.84 | LED13.GND v43.44,57.41 v43.43,57.4 | LED14.GND v43.44,52.96 v43.43,52.96 | LED15.GND v43.44,48.52 v43.43,48.51 | LED16.GND v43.44,44.07 v43.43,44.07 | LED17.GND v43.44,39.62 v43.43,39.62 | LED18.GND v43.44,35.18 v43.43,35.18 | LED19.GND v43.44,30.73 v43.43,30.73 | LED20.GND v43.44,26.29 v43.43,26.29 | LED21.GND v43.44,21.84 v43.43,21.84 | LED22.GND v43.44,17.4 v43.43,17.4 | LED23.GND v43.44,12.96 v43.43,12.95 | LED24.GND v43.44,8.51 v43.43,8.51 | LED25.GND v38.99,57.41 v38.99,57.4 | LED26.GND v38.99,52.96 | LED27.GND v38.99,48.52 v38.99,48.51 | LED28.GND v38.99,44.07 | LED29.GND v38.99,39.62 | LED30.GND v38.99,35.18 | LED31.GND v38.99,30.73 | LED32.GND v38.99,26.29 | LED33.GND v38.99,21.84 | LED34.GND v38.99,17.4 | LED35.GND v38.99,12.96 v38.99,12.95 | LED36.GND v38.99,8.51 | LED37.GND v34.55,57.41 v34.54,57.4 | LED38.GND v34.55,52.96 v34.54,52.96 | LED39.GND v34.55,48.52 v34.54,48.51 | LED40.GND v34.55,44.07 v34.54,44.07 | LED41.GND v34.55,39.62 v34.54,39.62 | LED42.GND v34.55,35.18 v34.54,35.18 | LED43.GND v34.55,30.73 v34.54,30.73 | LED44.GND v34.55,26.29 v34.54,26.29 | LED45.GND v34.55,21.84 v34.54,21.84 | LED46.GND v34.55,17.4 v34.54,17.4 | LED47.GND v34.55,12.96 v34.54,12.95 | LED48.GND v34.55,8.51 v34.54,8.51 | LED49.GND v30.1,57.41 v30.1,57.4 | LED50.GND v30.1,52.96 | LED51.GND v30.1,48.52 v30.1,48.51
  Top 0.406: LED52.GND v30.1,44.07 | LED53.GND v30.1,39.62 | LED54.GND v30.1,35.18 | LED55.GND v30.1,30.73 | LED56.GND v30.1,26.29 | LED57.GND v30.1,21.84 | LED58.GND v30.1,17.4 | LED59.GND v30.1,12.96 v30.1,12.95 | LED60.GND v30.1,8.51 | LED61.GND v25.66,57.41 v25.65,57.4 | LED62.GND v25.66,52.96 v25.65,52.96 | LED63.GND v25.66,48.52 v25.65,48.51 | LED64.GND v25.66,44.07 v25.65,44.07 | LED65.GND v25.66,39.62 v25.65,39.62 | LED66.GND v25.66,35.18 v25.65,35.18 | LED67.GND v25.66,30.73 v25.65,30.73 | LED68.GND v25.66,26.29 v25.65,26.29 | LED69.GND v25.66,21.84 v25.65,21.84 | LED70.GND v25.66,17.4 v25.65,17.4 | LED71.GND v25.66,12.96 v25.65,12.95 | LED72.GND v25.66,8.51 v25.65,8.51 | LED73.GND v21.21,57.41 v21.21,57.4 | LED74.GND v21.21,52.96 | LED75.GND v21.21,48.52 v21.21,48.51 | LED76.GND v21.21,44.07 | LED77.GND v21.21,39.62 | LED78.GND v21.21,35.18 | LED79.GND v21.21,30.73 | LED80.GND v21.21,26.29 | LED81.GND v21.21,21.84 | LED82.GND v21.21,17.4 | LED83.GND v21.21,12.96 v21.21,12.95 | LED84.GND v21.21,8.51 | LED85.GND v16.77,57.41 v16.76,57.4 | LED86.GND v16.77,52.96 v16.76,52.96 | LED87.GND v16.77,48.52 v16.76,48.51 | LED88.GND v16.77,44.07 v16.76,44.07 | LED89.GND v16.77,39.62 v16.76,39.62 | LED90.GND v16.77,35.18 v16.76,35.18 | LED91.GND v16.77,30.73 v16.76,30.73 | LED92.GND v16.77,26.29 v16.76,26.29 | LED93.GND v16.77,21.84 v16.76,21.84 | LED94.GND v16.77,17.4 v16.76,17.4 | LED95.GND v16.77,12.96 v16.76,12.95 | LED96.GND v16.77,8.51 v16.76,8.51 | LED97.GND v12.32,57.41 v12.32,57.4 | LED109.GND v7.88,57.41 v7.87,57.4 | LED98.GND v12.32,52.96 | LED110.GND v7.88,52.96 v7.87,52.96 | LED99.GND v12.32,48.52 v12.32,48.51 | LED111.GND v7.88,48.52 v7.87,48.51
  Top 0.406: LED100.GND v12.32,44.07 | LED112.GND v7.88,44.07 v7.87,44.07 | LED101.GND v12.32,39.62 | LED113.GND v7.88,39.62 v7.87,39.62 | LED102.GND v12.32,35.18 | LED114.GND v7.88,35.18 v7.87,35.18 | LED103.GND v12.32,30.73 | LED115.GND v7.88,30.73 v7.87,30.73 | LED104.GND v12.32,26.29 | LED116.GND v7.88,26.29 v7.87,26.29 | LED105.GND v12.32,21.84 | LED117.GND v7.88,21.84 v7.87,21.84 | LED106.GND v12.32,17.4 | LED118.GND v7.88,17.4 v7.87,17.4 | LED107.GND v12.32,12.96 v12.32,12.95 | LED119.GND v7.88,12.96 v7.87,12.95 | LED108.GND v12.32,8.51 | LED120.GND v7.88,8.51 v7.87,8.51
  Top 0.813: C4.2 1.15,48.7 v1.14,48.69 | C4.2 4.05,48.7 v4.06,48.69 | C4.2 v2.54,50.04 | C6.2 v2.54,19.43 | C6.2 1.18,18.09 v1.17,18.09 | C6.2 3.92,18.09 v3.94,18.11 | C5.2 v2.54,34.67 | C5.2 2.61,33.4 v3.94,33.4 | C5.2 1.58,33.34 v1.14,33.78 | C7.2 v18.29,5.21 | C7.2 18.22,3.94 v16.89,3.94 | C7.2 18.35,3.94 v19.69,3.94 | C9.2 v39.99,3.9 v39.98,3.89 | C9.2 41.4,5.21 v41.38,5.23 | C9.2 42.78,3.9 v42.8,3.91 | C8.2 v30.35,5.21 | C8.2 30.29,3.94 v28.96,3.94 | C8.2 30.42,3.94 v31.75,3.94 | v9.02,59.87 C3.2 9.03,61.16 | v10.39,61.16 9.03,61.16 | v7.62,61.14 7.65,61.16 9.03,61.16 | v37.16,60.2 v38.33,60.2 C1.2 | v15.49,61.09 16.83,61.09 | 16.83,61.09 C2.2 | v18.29,61.09 16.83,61.09 | v16.89,59.82 16.89,61.02 16.83,61.09
  other vias: 6.76,63.7 0.61,57.76 49.25,63.63 55.45,57.78 54.58,6.96 50.19,0.58 6.83,1.4 1.35,6.73 55.45,32.23 0.53,31.98 27.89,0.53 18.95,63.86 37.06,63.78
  pour Bottom (isolate 0.254, no thermals): 0,0 0,65.15 59.69,65.15 59.69,0
  pour Route2 (isolate 0.254, no thermals): 0,0 56.01,0 56.01,68.71 0,68.71
  cutout Top: 3.5,58 arc-180 3.5,65 arc-180
  cutout Route2: 3.5,58 arc-180 3.5,65 arc-180
  cutout Route15: 3.5,58 arc-180 3.5,65 arc-180
  cutout Bottom: 3.5,58 arc-180 3.5,65 arc-180
GND1
  cutout Top: 3.5,0 arc-180 3.5,7 arc-180
  cutout Route2: 3.5,0 arc-180 3.5,7 arc-180
  cutout Route15: 3.5,0 arc-180 3.5,7 arc-180
  cutout Bottom: 3.5,0 arc-180 3.5,7 arc-180
GND2
  cutout Top: 52.5,0 arc-180 52.5,7 arc-180
  cutout Route2: 52.5,0 arc-180 52.5,7 arc-180
  cutout Route15: 52.5,0 arc-180 52.5,7 arc-180
  cutout Bottom: 52.5,0 arc-180 52.5,7 arc-180
GND3
  cutout Top: 52.5,58 arc-180 52.5,65 arc-180
  cutout Route2: 52.5,58 arc-180 52.5,65 arc-180
  cutout Route15: 52.5,58 arc-180 52.5,65 arc-180
  cutout Bottom: 52.5,58 arc-180 52.5,65 arc-180
GPIO10
  Bottom 0.152: SJ1.3 46.57,59.69 47.07,59.19 48.6,59.19 49.35,58.43 49.35,34.5 50.1,33.76 J5.10
GPIO18
  Bottom 0.152: 46.88,61.34 SJ1.4 48.01,61.21 48.51,60.71 48.51,59.82 49.78,58.55 49.78,46.31 50.91,45.19 51.85,45.19 53.12,43.91 J6.6
GPIO21
  Bottom 0.152: SJ1.1 46.1,62.99 45.56,62.45 45.33,62.45 44.48,61.59 44.48,61.09 45.21,60.36 45.21,59.05 45.51,58.75 48.43,58.75 48.92,58.27 48.92,11.54 50.86,9.6 51.77,9.6 53.02,8.36 J6.20
N$1
  Top 0.203: LED1.DO 47.73,55.53 46.26,54.07 LED2.DI
N$2
  Top 0.203: LED2.DO 47.73,51.09 46.26,49.62 LED3.DI
N$3
  Top 0.203: LED3.DO 47.73,46.64 46.26,45.18 LED4.DI
N$4
  Top 0.203: LED4.DO 47.73,42.2 46.26,40.73 LED5.DI
N$5
  Top 0.203: LED5.DO 47.73,37.75 46.26,36.29 LED6.DI
N$6
  Top 0.203: LED6.DO 47.73,33.31 46.26,31.84 LED7.DI
N$7
  Top 0.203: LED7.DO 47.7,28.86 46.24,27.4 LED8.DI
N$8
  Top 0.203: LED8.DO 47.73,24.42 46.26,22.95 LED9.DI
N$9
  Top 0.203: LED9.DO 47.73,19.97 46.26,18.51 LED10.DI
N$10
  Top 0.203: LED10.DO 47.73,15.53 46.26,14.06 LED11.DI
N$11
  Top 0.203: LED20.DO 43.28,24.42 41.82,22.95 LED21.DI
N$12
  Top 0.203: LED11.DO 47.73,11.08 46.26,9.62 LED12.DI
N$13
  Top 0.203: LED12.DO 47.88,7.25 46.49,8.64 45.59,8.64 44.83,9.4 44.83,55.62 43.94,56.51 43.04,56.51 41.66,57.9 LED13.DI
N$14
  Top 0.203: LED13.DO 43.28,55.53 41.82,54.07 LED14.DI
N$15
  Top 0.203: LED14.DO 43.28,51.09 41.82,49.62 LED15.DI
N$16
  Top 0.203: LED15.DO 43.28,46.64 41.82,45.18 LED16.DI
N$17
  Top 0.203: LED16.DO 43.28,42.2 41.82,40.73 LED17.DI
N$18
  Top 0.203: LED17.DO 43.28,37.75 41.82,36.29 LED18.DI
N$19
  Top 0.203: LED18.DO 43.28,33.31 41.82,31.84 LED19.DI
N$20
  Top 0.203: LED19.DO 43.28,28.86 41.82,27.4 LED20.DI
N$22
  Top 0.203: LED21.DO 43.28,19.97 41.82,18.51 LED22.DI
N$23
  Top 0.203: LED22.DO 43.28,15.53 41.82,14.06 LED23.DI
N$24
  Top 0.203: LED23.DO 43.28,11.08 41.82,9.62 LED24.DI
N$25
  Top 0.203: LED24.DO 43.44,7.22 42.02,8.64 41.15,8.64 40.26,9.53 40.26,55.75 39.5,56.51 38.6,56.51 37.21,57.9 LED25.DI
N$26
  Top 0.203: LED25.DO 38.84,55.53 37.37,54.07 LED26.DI
N$27
  Top 0.203: LED26.DO 38.84,51.09 37.37,49.62 LED27.DI
N$28
  Top 0.203: LED27.DO 38.81,46.64 37.35,45.18 LED28.DI
N$29
  Top 0.203: LED28.DO 38.84,42.2 37.37,40.73 LED29.DI
N$30
  Top 0.203: LED29.DO 38.84,37.75 37.37,36.29 LED30.DI
N$31
  Top 0.203: LED30.DO 38.84,33.31 37.37,31.84 LED31.DI
N$32
  Top 0.203: LED31.DO 38.84,28.86 37.37,27.4 LED32.DI
N$33
  Top 0.203: LED32.DO 38.84,24.42 37.37,22.95 LED33.DI
N$34
  Top 0.203: LED33.DO 38.84,19.97 37.37,18.51 LED34.DI
N$35
  Top 0.203: LED34.DO 38.84,15.53 37.37,14.06 LED35.DI
N$36
  Top 0.203: LED35.DO 38.84,11.08 37.37,9.62 LED36.DI
N$37
  Top 0.203: LED36.DO 38.99,7.25 37.6,8.64 36.71,8.64 35.81,9.53 35.81,55.75 35.05,56.51 34.18,56.51 32.77,57.93 LED37.DI
N$38
  Top 0.203: LED37.DO 34.39,55.53 32.93,54.07 LED38.DI
N$39
  Top 0.203: LED38.DO 34.39,51.09 32.93,49.62 LED39.DI
N$40
  Top 0.203: LED39.DO 34.39,46.64 32.93,45.18 LED40.DI
N$41
  Top 0.203: LED40.DO 34.39,42.2 32.93,40.73 LED41.DI
N$42
  Top 0.203: LED41.DO 34.39,37.75 32.93,36.29 LED42.DI
N$43
  Top 0.203: LED42.DO 34.39,33.31 32.93,31.84 LED43.DI
N$44
  Top 0.203: LED43.DO 34.39,28.86 32.93,27.4 LED44.DI
N$45
  Top 0.203: LED44.DO 34.39,24.42 32.93,22.95 LED45.DI
N$46
  Top 0.203: LED45.DO 34.37,19.97 32.9,18.51 LED46.DI
N$47
  Top 0.203: LED46.DO 34.39,15.53 32.93,14.06 LED47.DI
N$48
  Top 0.203: LED47.DO 34.37,11.08 32.9,9.62 LED48.DI
N$49
  Top 0.203: LED48.DO 34.55,7.25 33.16,8.64 32.26,8.64 31.37,9.53 31.37,55.75 30.61,56.51 29.71,56.51 28.32,57.9 LED49.DI
N$50
  Top 0.203: LED49.DO 29.95,55.53 28.48,54.07 LED50.DI
N$51
  Top 0.203: LED50.DO 29.95,51.09 28.48,49.62 LED51.DI
N$52
  Top 0.203: LED69.DO 25.49,19.97 24.03,18.51 LED70.DI
N$53
  Top 0.203: LED51.DO 29.95,46.64 28.48,45.18 LED52.DI
N$54
  Top 0.203: LED52.DO 29.95,42.2 28.48,40.73 LED53.DI
N$55
  Top 0.203: LED53.DO 29.95,37.75 28.48,36.29 LED54.DI
N$56
  Top 0.203: LED54.DO 29.92,33.31 28.46,31.84 LED55.DI
N$57
  Top 0.203: LED55.DO 29.95,28.86 28.48,27.4 LED56.DI
N$58
  Top 0.203: LED56.DO 29.95,24.42 28.48,22.95 LED57.DI
N$59
  Top 0.203: LED57.DO 29.95,19.97 28.48,18.51 LED58.DI
N$60
  Top 0.203: LED58.DO 29.95,15.53 28.48,14.06 LED59.DI
N$61
  Top 0.203: LED59.DO 29.95,11.08 28.48,9.62 LED60.DI
N$63
  Top 0.203: LED61.DO 25.5,55.53 24.04,54.07 LED62.DI
N$64
  Top 0.203: LED62.DO 25.5,51.09 24.04,49.62 LED63.DI
N$65
  Top 0.203: LED63.DO 25.5,46.64 24.04,45.18 LED64.DI
N$66
  Top 0.203: LED64.DO 25.5,42.2 24.04,40.73 LED65.DI
N$67
  Top 0.203: LED65.DO 25.5,37.75 24.04,36.29 LED66.DI
N$68
  Top 0.203: LED66.DO 25.5,33.31 24.04,31.84 LED67.DI
N$69
  Top 0.203: LED67.DO 25.48,28.86 24.01,27.4 LED68.DI
N$70
  Top 0.203: LED68.DO 25.49,24.42 24.03,22.95 LED69.DI
N$71
  Top 0.203: LED70.DO 25.5,15.53 24.04,14.06 LED71.DI
N$72
  Top 0.203: LED71.DO 25.5,11.08 24.04,9.62 LED72.DI
N$73
  Top 0.203: LED72.DO 25.66,7.25 24.27,8.64 23.37,8.64 22.48,9.53 22.48,55.75 21.72,56.51 20.82,56.51 19.43,57.9 LED73.DI
N$74
  Top 0.203: LED73.DO 21.06,55.53 19.59,54.07 LED74.DI
N$75
  Top 0.203: LED74.DO 21.06,51.09 19.59,49.62 LED75.DI
N$76
  Top 0.203: LED75.DO 21.06,46.64 19.59,45.18 LED76.DI
N$77
  Top 0.203: LED76.DO 21.06,42.2 19.59,40.73 LED77.DI
N$78
  Top 0.203: LED77.DO 21.06,37.75 19.59,36.29 LED78.DI
N$79
  Top 0.203: LED78.DO 21.06,33.31 19.59,31.84 LED79.DI
N$80
  Top 0.203: LED79.DO 21.06,28.86 19.59,27.4 LED80.DI
N$81
  Top 0.203: LED80.DO 21.06,24.42 19.59,22.95 LED81.DI
N$82
  Top 0.203: LED81.DO 21.06,19.97 19.59,18.51 LED82.DI
N$83
  Top 0.203: LED82.DO 21.06,15.53 19.59,14.06 LED83.DI
N$84
  Top 0.203: LED83.DO 21.06,11.08 19.59,9.62 LED84.DI
N$85
  Top 0.203: LED84.DO 21.21,7.25 19.82,8.64 18.93,8.64 18.03,9.53 18.03,55.75 17.27,56.51 16.37,56.51 14.99,57.9 LED85.DI
N$86
  Top 0.203: LED85.DO 16.61,55.53 15.15,54.07 LED86.DI
N$87
  Top 0.203: LED86.DO 16.61,51.09 15.17,49.65 LED87.DI
N$88
  Top 0.203: LED87.DO 16.61,46.67 15.12,45.18 LED88.DI
N$89
  Top 0.203: LED88.DO 16.61,42.2 15.15,40.73 LED89.DI
N$90
  Top 0.203: LED89.DO 16.61,37.75 15.15,36.29 LED90.DI
N$91
  Top 0.203: LED90.DO 16.61,33.31 15.15,31.84 LED91.DI
N$92
  Top 0.203: LED91.DO 16.61,28.86 15.15,27.4 LED92.DI
N$93
  Top 0.203: LED92.DO 16.61,24.42 15.15,22.95 LED93.DI
N$94
  Top 0.203: LED93.DO 16.61,19.97 15.15,18.51 LED94.DI
N$95
  Top 0.203: LED94.DO 16.61,15.53 15.15,14.06 LED95.DI
N$96
  Top 0.203: LED95.DO 16.61,11.08 15.15,9.62 LED96.DI
N$97
  Top 0.203: LED96.DO 16.77,7.25 15.38,8.64 14.48,8.64 13.59,9.53 13.59,55.75 12.83,56.51 11.96,56.51 10.54,57.93 LED97.DI
N$98
  Top 0.203: LED97.DO 12.17,55.53 10.7,54.07 LED98.DI
N$99
  Top 0.203: LED98.DO 12.17,51.09 10.7,49.62 LED99.DI
N$100
  Top 0.203: LED99.DO 12.14,46.64 10.68,45.18 LED100.DI
N$101
  Top 0.203: LED100.DO 12.17,42.2 10.7,40.73 LED101.DI
N$102
  Top 0.203: LED101.DO 12.17,37.75 10.7,36.29 LED102.DI
N$103
  Top 0.203: LED102.DO 12.17,33.31 10.7,31.84 LED103.DI
N$104
  Top 0.203: LED103.DO 12.17,28.86 10.7,27.4 LED104.DI
N$105
  Top 0.203: LED104.DO 12.17,24.42 10.7,22.95 LED105.DI
N$106
  Top 0.203: LED105.DO 12.17,19.97 10.7,18.51 LED106.DI
N$107
  Top 0.203: LED106.DO 12.17,15.53 10.7,14.06 LED107.DI
N$108
  Top 0.203: LED107.DO 12.17,11.08 10.7,9.62 LED108.DI
N$109
  Top 0.203: LED108.DO 12.32,7.25 10.93,8.64 10.04,8.64 9.14,9.53 9.14,55.75 8.38,56.51 7.48,56.51 6.1,57.9 LED109.DI
N$110
  Top 0.203: LED109.DO 7.72,55.53 6.26,54.07 LED110.DI
N$111
  Top 0.203: LED110.DO 7.72,51.09 6.26,49.62 LED111.DI
N$112
  Top 0.203: LED111.DO 7.72,46.64 6.26,45.18 LED112.DI
N$113
  Top 0.203: LED112.DO 7.72,42.2 6.26,40.73 LED113.DI
N$114
  Top 0.203: LED113.DO 7.7,37.75 6.23,36.29 LED114.DI
N$115
  Top 0.203: LED114.DO 7.72,33.31 6.26,31.84 LED115.DI
N$116
  Top 0.203: LED115.DO 7.72,28.86 6.26,27.4 LED116.DI
N$117
  Top 0.203: LED116.DO 7.72,24.42 6.26,22.95 LED117.DI
N$118
  Top 0.203: LED117.DO 7.72,19.97 6.26,18.51 LED118.DI
N$119
  Top 0.203: LED118.DO 7.72,15.53 6.26,14.06 LED119.DI
N$120
  Top 0.203: LED119.DO 7.72,11.08 6.26,9.62 LED120.DI
N$143
  Top 0.305: R1.2 48,60.84 47.5,61.34 46.48,61.34 46.36,61.21 IC1.5

### Text on the board
tPlace: 5V | DI | GND | 2 | 3 | 4 | 5 | 6 | 7 | 8 | 9 | 10 | 11 | 12 | 13 | 14 | 15 | 16 | 17 | 18 | 19 | 20 | 21 | 22 | 23 | 24 | 25 | 26 | 27 | 28 | 29 | 30 | 31 | 32 | 33 | 34 | 35 | 36 | 37 | 38 | 39 | 40 | LED-plus35 -SHIM v1.0 | 5V | DO | GND
bPlace: GPIO21 | GPIO10 | GPIO18 | http://redscorp.net | (c) Andriy Golovnya | BOTTOM SIDE